# EAGLE board A13-OLinuXino-MICRO_Rev_C (EAGLE 4.16), part 1 of 3
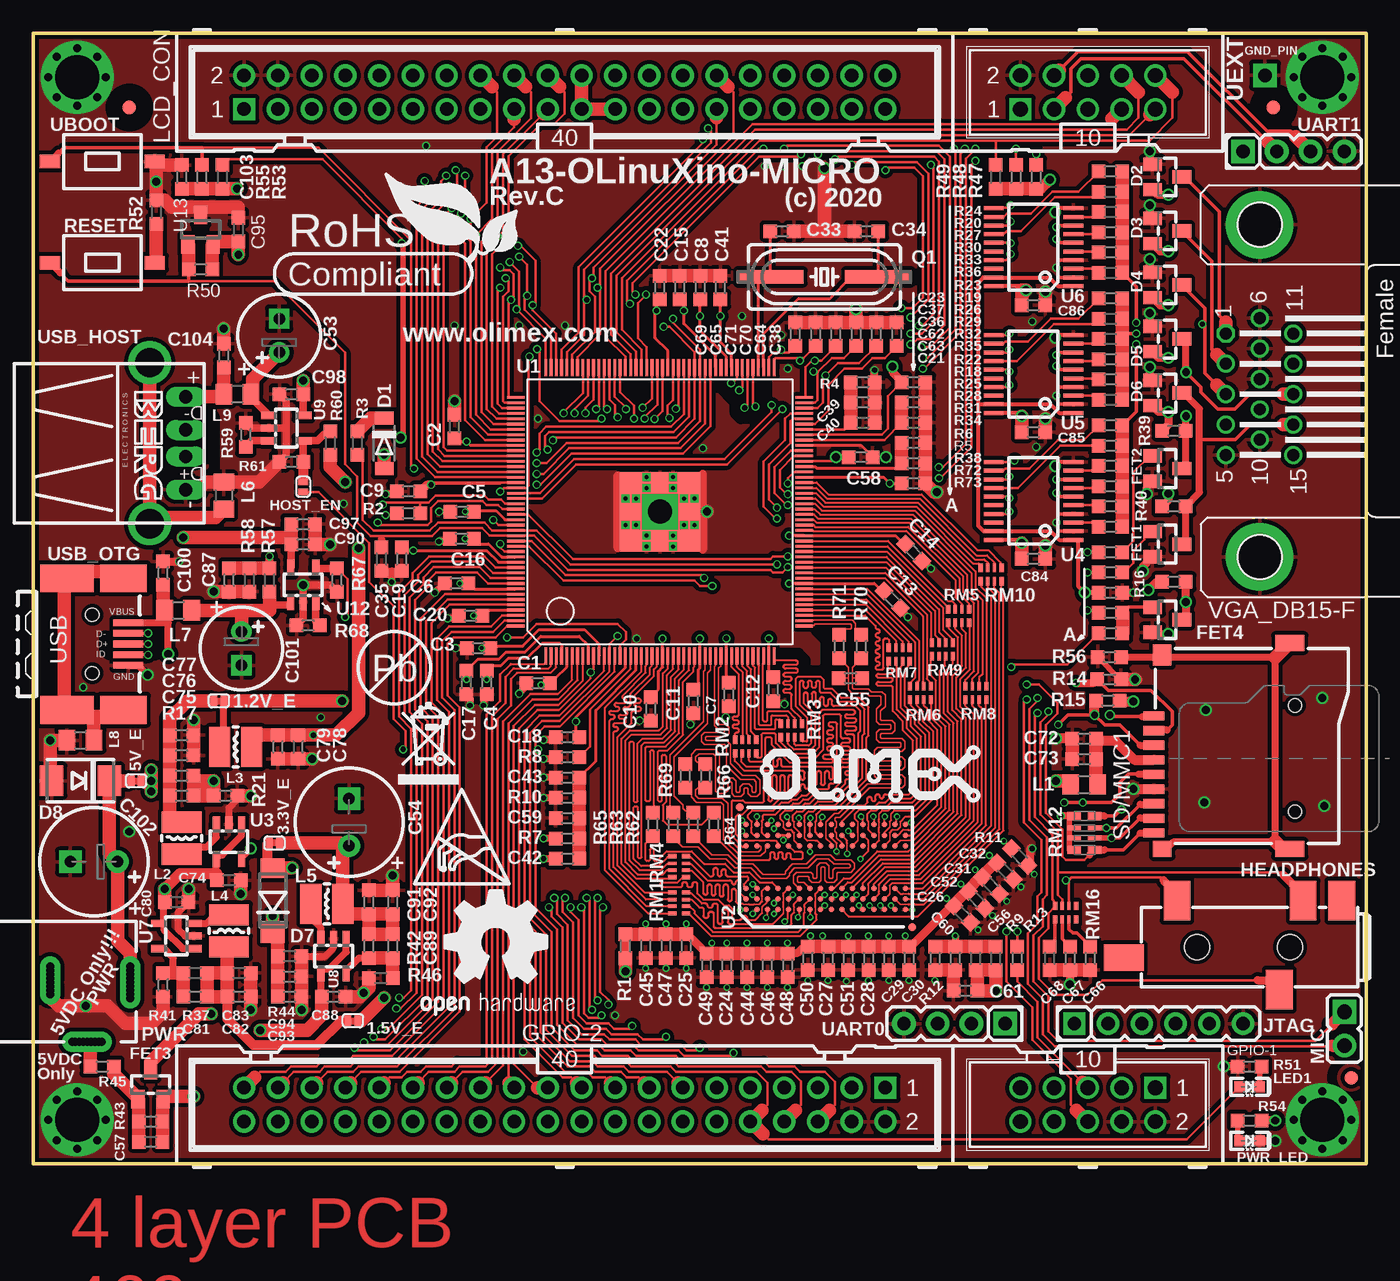
[diagram p2: board, top side]
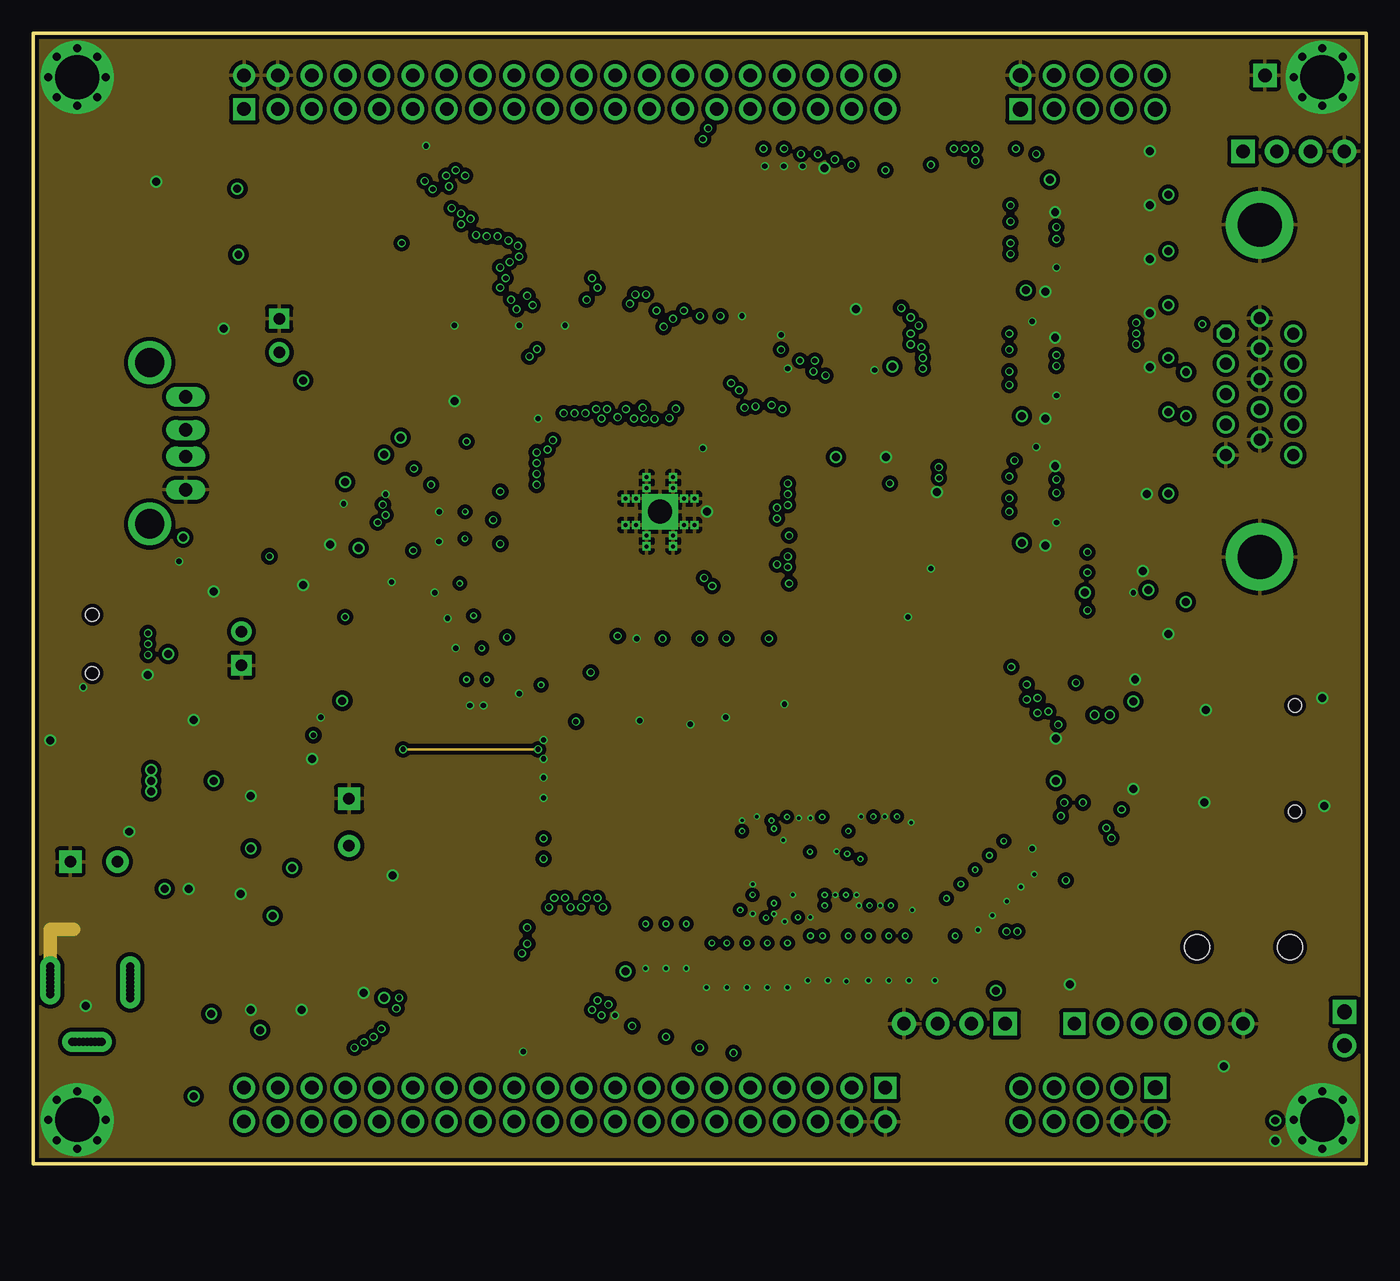
[diagram p3: board, inner layer Route2]
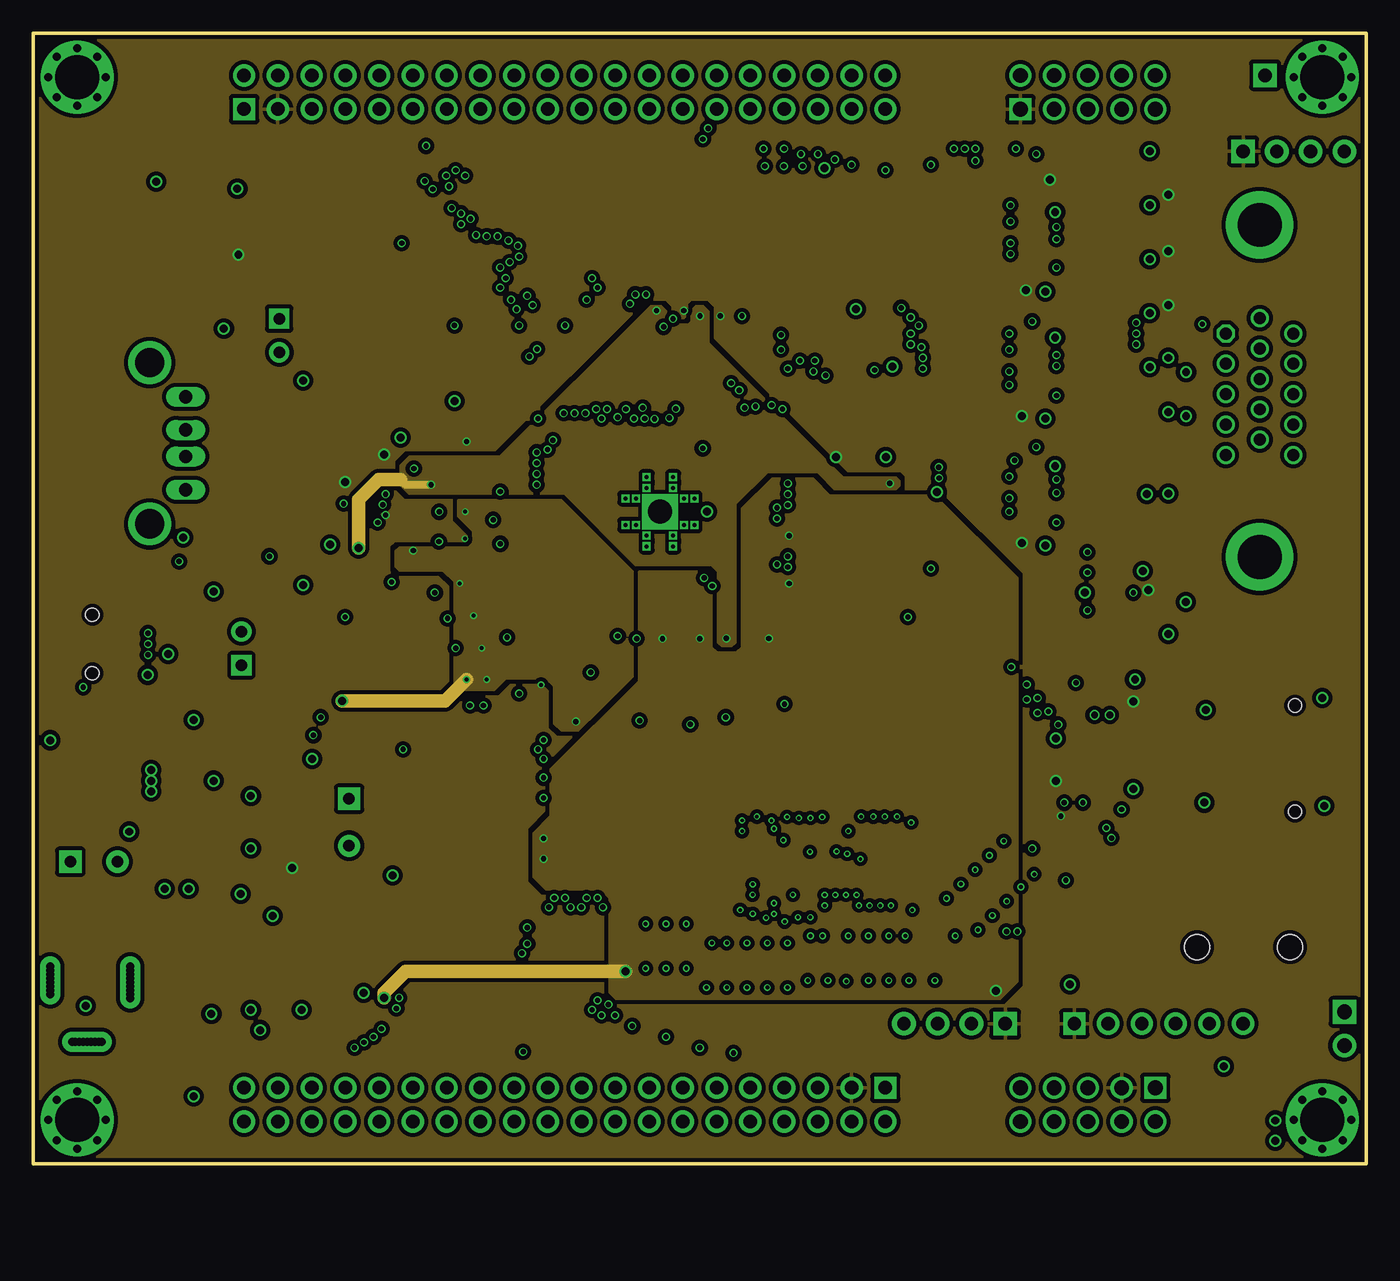
[diagram p4: board, inner layer Route15]
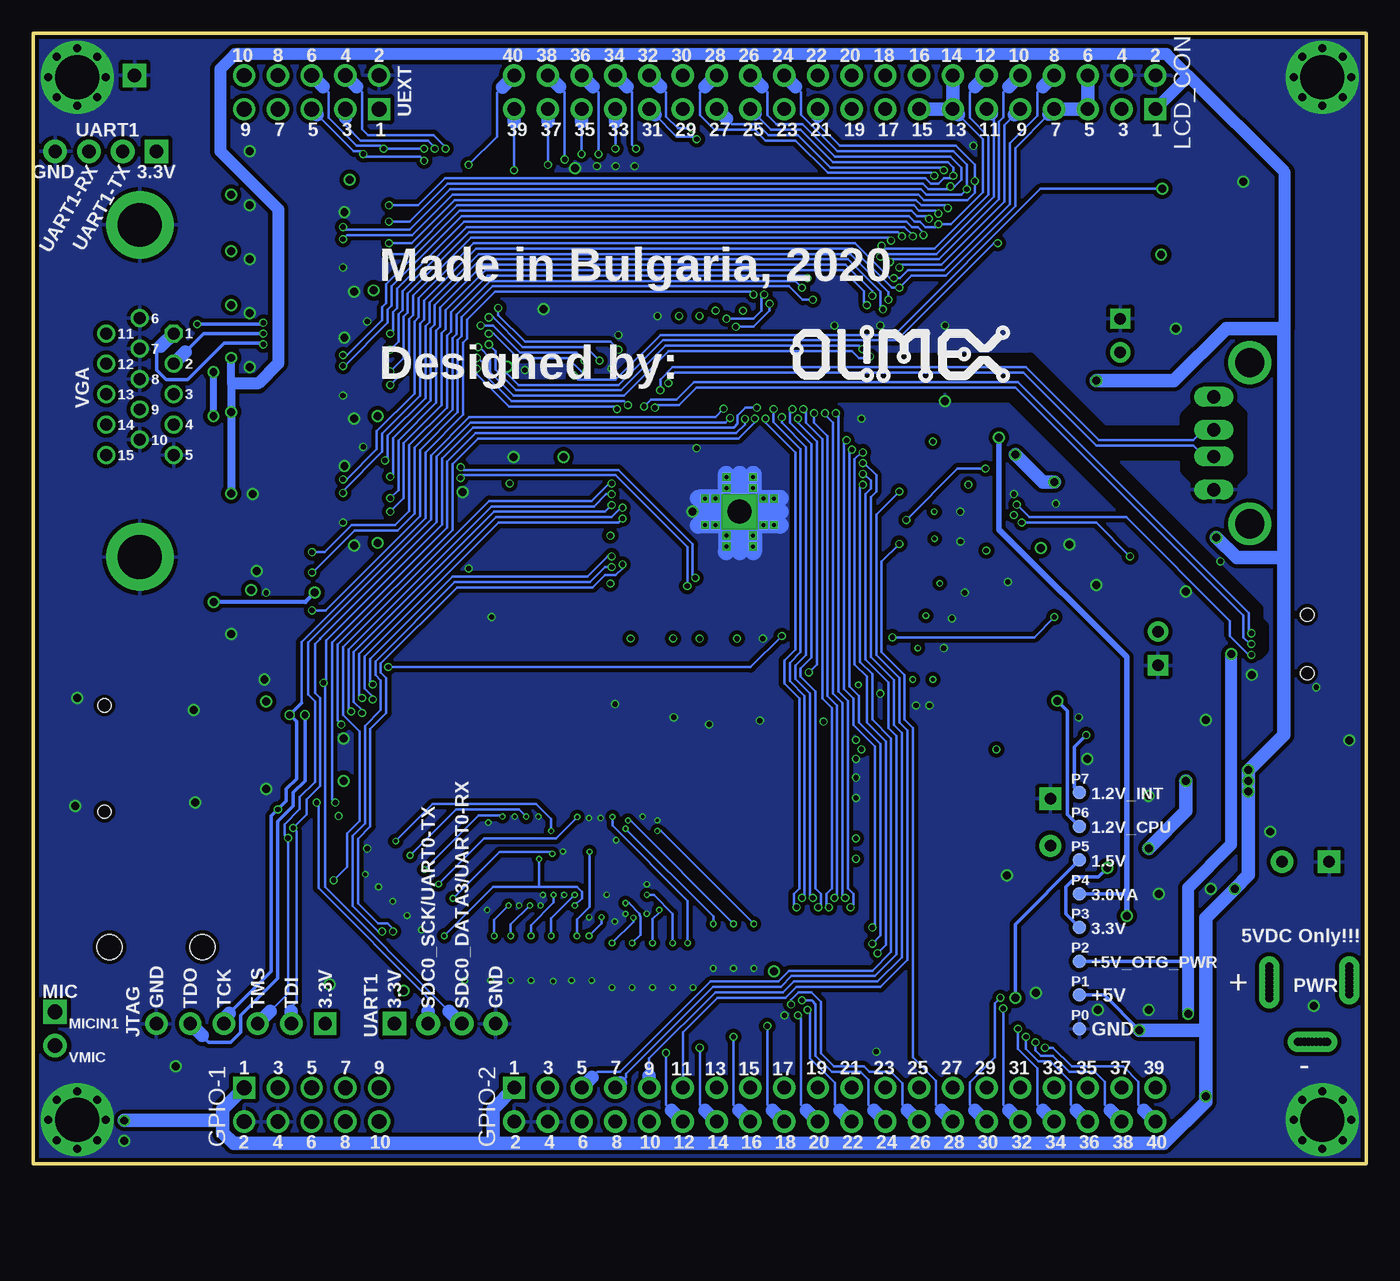
[diagram p5: board, bottom side, seen from below]

Size 100.33 x 85.09 mm. Coordinates in mm from the lower left corner, seen from the top.
Outline: 0,85.09 0,0 100.33,0 100.33,85.09 0,85.09
Copper layers (1*2+15*16): Top 0.035mm / dielectric 0.5mm / Route2 0.035mm / dielectric 0.5mm / Route15 0.035mm / dielectric 0.5mm / Bottom 0.035mm
Design rules "default": minimum track width 4.5mil, minimum drill 10mil, track to track 0.1321mm, track to pad 0.1321mm, pad to pad 0.1321mm, via to via 0.1321mm, smd to smd 1mil, copper to edge 10mil, drill to drill 8mil, minimum pad ring 6mil, minimum via ring 4mil, stop-mask expansion 4mil, vias tented up to drill 25mil, thermal gap 12mil
tRestrict: 28 lines
bRestrict: 31 lines

## Footprints (pad centres in the part's own frame; a part is rotated, then mirrored left to right if it is on the bottom)
SJ_1_SMALLER_CLOSE = smd 0.508 x 0.762: 1 -0.381,0; 2 0.381,0
C0603_DWS = smd 1.016 x 1.016: 1 -0.889,0; 2 0.889,0
E2,5-6,3 = drill 0.864 pad 1.524 round: + -1.27,0 | drill 0.864 pad 1.524 square: - 1.27,0
E3,5-8 = drill 0.864 pad 1.676 round: + -1.778,0 | drill 0.864 pad 1.676 square: - 1.778,0
SOD-123 = smd 1 x 1.4: A 1.9,0; C -1.9,0
SOT23C(BAT54S) = smd 1.4 x 1: 1 1.1,-0.95; 2 1.1,0.95; 3 -1.1,0
MLL-41 = smd 1.45 x 1.8: A 2.445,0; K -2.445,0
DO214AA = smd 1.778 x 2.286: A 2.177,0; C -2.177,0
SOT23 = smd 1.4 x 1: 1 1.1,-0.95; 2 1.1,0.95; 3 -1.1,0
TEST_PAD40/70/SQUARE = drill 1.016 pad 1.778 square: P$1 0,0
ML10-MALE = drill 1.1 pad 1.676 square: 1 -5.08,-1.27 | drill 1.1 pad 1.676 round: 2 -5.08,1.27; 3 -2.54,-1.27; 4 -2.54,1.27; 5 0,-1.27; 6 0,1.27; 7 2.54,-1.27; 8 2.54,1.27; 9 5.08,-1.27; 10 5.08,1.27
ML40 = drill 1.016 pad 1.676 square: 1 -24.13,-1.27 | drill 1.016 pad 1.676 round: 2 -24.13,1.27; 3 -21.59,-1.27; 4 -21.59,1.27; 5 -19.05,-1.27; 6 -19.05,1.27; 7 -16.51,-1.27; 8 -16.51,1.27; 9 -13.97,-1.27; 10 -13.97,1.27; 11 -11.43,-1.27; 12 -11.43,1.27; 13 -8.89,-1.27; 14 -8.89,1.27; 15 -6.35,-1.27; 16 -6.35,1.27; 17 -3.81,-1.27; 18 -3.81,1.27; 19 -1.27,-1.27; 20 -1.27,1.27; 21 1.27,-1.27; 22 1.27,1.27; 23 3.81,-1.27; 24 3.81,1.27; 25 6.35,-1.27; 26 6.35,1.27; 27 8.89,-1.27; 28 8.89,1.27; 29 11.43,-1.27; 30 11.43,1.27; 31 13.97,-1.27; 32 13.97,1.27; 33 16.51,-1.27; 34 16.51,1.27; 35 19.05,-1.27; 36 19.05,1.27; 37 21.59,-1.27; 38 21.59,1.27; 39 24.13,-1.27; 40 24.13,1.27
PJ-W47S-05D2-LF_5PIN_V2 = smd 2 x 3: 1 2.1,-0.5; 2 14.5,-0.5; 3 6.8,6.2; 5 5,-0.5 | smd 3 x 2: 4 18.5,3.8 | hole 1.9: 6,3; 13,3
SJ_1_SMALLER = smd 0.508 x 0.762: 1 -0.381,0; 2 0.381,0
HN1X6 = drill 1 pad 1.676 square: 1 -6.35,0 | drill 1 pad 1.676 round: 2 -3.81,0; 3 -1.27,0; 4 1.27,0; 5 3.81,0; 6 6.35,0
L0805_5MIL_DWS = smd 1.27 x 1.524: 1 -1.016,0; 2 1.016,0
CD32 = smd 1.6 x 3: 1 -1.2,0; 2 1.2,0
LED-0603 = smd 0.8 x 0.8: A 0.762,0; C -0.762,0
JP1 = drill 1.1 pad 1.778 square: 1 0,-1.27 | drill 1.1 pad 1.778 round: 2 0,1.27
TESTPAD_40-ROUND = smd 1.016 x 1.016: 1 0,0
PWR_JACK_UNI_MILLING = drill 0.6 pad 1.5 round: + -0.196,4.75; +1 -0.196,5.05; +2 -0.196,5.35; +3 -0.196,5.65; +4 -0.196,4.45; +5 -0.196,4.15; +6 -0.196,3.85; +7 -0.196,3.55; +8 -0.196,5.95; - -6.196,4.75; -1 -6.196,5.05; -2 -6.196,5.35; -3 -6.196,4.45; -4 -6.196,4.15; -5 -6.196,5.65; -6 -6.196,3.85; -8 -6.196,5.95; -- -3.446,0.3; --1 -3.746,0.3; --2 -4.046,0.3; --3 -4.346,0.3; --4 -3.146,0.3; --5 -2.846,0.3; --6 -2.546,0.3; --14 -4.546,0.3; --15 -2.346,0.3
HC49/SMD2_THIN = smd 5 x 1: 1 -4.064,0; 2 4.064,0
0603_0R = smd 1.016 x 1.016: 1 -0.889,0; 2 0.889,0
R0603_5MIL_DWS = smd 1.016 x 1.016: 1 -0.889,0; 2 0.889,0
SW-TAKT_6X3.5_SMD = smd 1.016 x 1.524: P$1 0,3.937; P$2 0,-3.937
R_MATRIX_4_0402_25X625 = smd 0.325 x 0.625: 1.1 -0.79,-0.512; 1.2 -0.79,0.512; 4.1 0.79,-0.512; 4.2 0.79,0.512 | smd 0.25 x 0.625: 2.1 -0.25,-0.512; 2.2 -0.25,0.512; 3.1 0.25,-0.512; 3.2 0.25,0.512
R_MATRIX_4 = smd 0.635 x 1.016: 1.1 -1.27,-0.762; 1.2 -1.27,0.762; 4.1 1.27,-0.762; 4.2 1.27,0.762 | smd 0.381 x 1.016: 2.1 -0.381,-0.762; 2.2 -0.381,0.762; 3.1 0.381,-0.762; 3.2 0.381,0.762
TFC-WPAPR-08 = smd 1.6 x 0.7: 1 -6.994,2.25; 2 -6.994,1.15; 3 -6.994,0.05; 4 -6.994,-1.05; 5 -6.994,-2.15; 6 -6.994,-3.25; 7 -6.994,-4.35; 8 -6.994,-5.45; 9 -6.994,-6.55 | smd 1.4 x 1.2: 10 -6.369,-7.75 | smd 1.4 x 1.6: 11 -6.369,6.85 | smd 2.2 x 1.2: 12 3.231,-7.75; 13 3.231,7.75 | hole 1: 3.631,-4.95; 3.631,3.05
TQFP176 = smd 0.2 x 1.3: 1 -8.6,-10.85; 2 -8.2,-10.85; 3 -7.8,-10.85; 4 -7.4,-10.85; 5 -7,-10.85; 6 -6.6,-10.85; 7 -6.2,-10.85; 8 -5.8,-10.85; 9 -5.4,-10.85; 10 -5,-10.85; 11 -4.6,-10.85; 12 -4.2,-10.85; 13 -3.8,-10.85; 14 -3.4,-10.85; 15 -3,-10.85; 16 -2.6,-10.85; 17 -2.2,-10.85; 18 -1.8,-10.85; 19 -1.4,-10.85; 20 -1,-10.85; 21 -0.6,-10.85; 22 -0.2,-10.85; 23 0.2,-10.85; 24 0.6,-10.85; 25 1,-10.85; 26 1.4,-10.85; 27 1.8,-10.85; 28 2.2,-10.85; 29 2.6,-10.85; 30 3,-10.85; 31 3.4,-10.85; 32 3.8,-10.85; 33 4.2,-10.85; 34 4.6,-10.85; 35 5,-10.85; 36 5.4,-10.85; 37 5.8,-10.85; 38 6.2,-10.85; 39 6.6,-10.85; 40 7,-10.85; 41 7.4,-10.85; 42 7.8,-10.85; 43 8.2,-10.85; 44 8.6,-10.85; 89 8.6,10.85; 90 8.2,10.85; 91 7.8,10.85; 92 7.4,10.85; 93 7,10.85; 94 6.6,10.85; 95 6.2,10.85; 96 5.8,10.85; 97 5.4,10.85; 98 5,10.85; 99 4.6,10.85; 100 4.2,10.85; 101 3.8,10.85; 102 3.4,10.85; 103 3,10.85; 104 2.6,10.85; 105 2.2,10.85; 106 1.8,10.85; 107 1.4,10.85; 108 1,10.85; 109 0.6,10.85; 110 0.2,10.85; 111 -0.2,10.85; 112 -0.6,10.85; 113 -1,10.85; 114 -1.4,10.85; 115 -1.8,10.85; 116 -2.2,10.85; 117 -2.6,10.85; 118 -3,10.85; 119 -3.4,10.85; 120 -3.8,10.85; 121 -4.2,10.85; 122 -4.6,10.85; 123 -5,10.85; 124 -5.4,10.85; 125 -5.8,10.85; 126 -6.2,10.85; 127 -6.6,10.85; 128 -7,10.85; 129 -7.4,10.85; 130 -7.8,10.85; 131 -8.2,10.85; 132 -8.6,10.85 | smd 1.3 x 0.2: 45 10.85,-8.6; 46 10.85,-8.2; 47 10.85,-7.8; 48 10.85,-7.4; 49 10.85,-7; 50 10.85,-6.6; 51 10.85,-6.2; 52 10.85,-5.8; 53 10.85,-5.4; 54 10.85,-5; 55 10.85,-4.6; 56 10.85,-4.2; 57 10.85,-3.8; 58 10.85,-3.4; 59 10.85,-3; 60 10.85,-2.6; 61 10.85,-2.2; 62 10.85,-1.8; 63 10.85,-1.4; 64 10.85,-1; 65 10.85,-0.6; 66 10.85,-0.2; 67 10.85,0.2; 68 10.85,0.6; 69 10.85,1; 70 10.85,1.4; 71 10.85,1.8; 72 10.85,2.2; 73 10.85,2.6; 74 10.85,3; 75 10.85,3.4; 76 10.85,3.8; 77 10.85,4.2; 78 10.85,4.6; 79 10.85,5; 80 10.85,5.4; 81 10.85,5.8; 82 10.85,6.2; 83 10.85,6.6; 84 10.85,7; 85 10.85,7.4; 86 10.85,7.8; 87 10.85,8.2; 88 10.85,8.6; 133 -10.85,8.6; 134 -10.85,8.2; 135 -10.85,7.8; 136 -10.85,7.4; 137 -10.85,7; 138 -10.85,6.6; 139 -10.85,6.2; 140 -10.85,5.8; 141 -10.85,5.4; 142 -10.85,5; 143 -10.85,4.6; 144 -10.85,4.2; 145 -10.85,3.8; 146 -10.85,3.4; 147 -10.85,3; 148 -10.85,2.6; 149 -10.85,2.2; 150 -10.85,1.8; 151 -10.85,1.4; 152 -10.85,1; 153 -10.85,0.6; 154 -10.85,0.2; 155 -10.85,-0.2; 156 -10.85,-0.6; 157 -10.85,-1; 158 -10.85,-1.4; 159 -10.85,-1.8; 160 -10.85,-2.2; 161 -10.85,-2.6; 162 -10.85,-3; 163 -10.85,-3.4; 164 -10.85,-3.8; 165 -10.85,-4.2; 166 -10.85,-4.6; 167 -10.85,-5; 168 -10.85,-5.4; 169 -10.85,-5.8; 170 -10.85,-6.2; 171 -10.85,-6.6; 172 -10.85,-7; 173 -10.85,-7.4; 174 -10.85,-7.8; 175 -10.85,-8.2; 176 -10.85,-8.6 | smd 6 x 6: GND_PAD 0,0 | drill 1.8 pad 2.184 square: P$2 0,0 | drill 0.3 pad 0.406 square: P$3 -2.6,-1; P$4 -1.8,-1; P$5 -1,-2.6; P$6 -1,-1.8; P$7 1,-2.6; P$8 1,-1.8; P$9 2.6,-1; P$10 1.8,-1; P$11 -2.6,1; P$12 -1.8,1; P$13 2.6,1; P$14 1.8,1; P$15 -1,2.6; P$16 -1,1.8; P$17 1,2.6; P$18 1,1.8
FBGA96@1 = smd 0.4 x 0.4: A1 -3.2,6; A2 -2.4,6; A3 -1.6,6; A7 1.6,6; A8 2.4,6; A9 3.2,6; B1 -3.2,5.2; B2 -2.4,5.2; B3 -1.6,5.2; B7 1.6,5.2; B8 2.4,5.2; B9 3.2,5.2; C1 -3.2,4.4; C2 -2.4,4.4; C3 -1.6,4.4; C7 1.6,4.4; C8 2.4,4.4; C9 3.2,4.4; D1 -3.2,3.6; D2 -2.4,3.6; D3 -1.6,3.6; D7 1.6,3.6; D8 2.4,3.6; D9 3.2,3.6; E1 -3.2,2.8; E2 -2.4,2.8; E3 -1.6,2.8; E7 1.6,2.8; E8 2.4,2.8; E9 3.2,2.8; F1 -3.2,2; F2 -2.4,2; F3 -1.6,2; F7 1.6,2; F8 2.4,2; F9 3.2,2; G1 -3.2,1.2; G2 -2.4,1.2; G3 -1.6,1.2; G7 1.6,1.2; G8 2.4,1.2; G9 3.2,1.2; H1 -3.2,0.4; H2 -2.4,0.4; H3 -1.6,0.4; H7 1.6,0.4; H8 2.4,0.4; H9 3.2,0.4; J1 -3.2,-0.4; J2 -2.4,-0.4; J3 -1.6,-0.4; J7 1.6,-0.4; J8 2.4,-0.4; J9 3.2,-0.4; K1 -3.2,-1.2; K2 -2.4,-1.2; K3 -1.6,-1.2; K7 1.6,-1.2; K8 2.4,-1.2; K9 3.2,-1.2; L1 -3.2,-2; L2 -2.4,-2; L3 -1.6,-2; L7 1.6,-2; L8 2.4,-2; L9 3.2,-2; M1 -3.2,-2.8; M2 -2.4,-2.8; M3 -1.6,-2.8; M7 1.6,-2.8; M8 2.4,-2.8; M9 3.2,-2.8; N1 -3.2,-3.6; N2 -2.4,-3.6; N3 -1.6,-3.6; N7 1.6,-3.6; N8 2.4,-3.6; N9 3.2,-3.6; P1 -3.2,-4.4; P2 -2.4,-4.4; P3 -1.6,-4.4; P7 1.6,-4.4; P8 2.4,-4.4; P9 3.2,-4.4; R1 -3.2,-5.2; R2 -2.4,-5.2; R3 -1.6,-5.2; R7 1.6,-5.2; R8 2.4,-5.2; R9 3.2,-5.2; T1 -3.2,-6; T2 -2.4,-6; T3 -1.6,-6; T7 1.6,-6; T8 2.4,-6; T9 3.2,-6 | smd 0.6 x 0.6: FID1 -4.5,-6.5; FID2 4.5,6.5
SOT23-5 = smd 1.2 x 0.55: 1 1.3,-0.95; 2 1.3,0; 3 1.3,0.95; 4 -1.3,0.95; 5 -1.3,-0.95
PW = smd 0.3 x 1.5: 1 -2.925,-3; 2 -2.275,-3; 3 -1.625,-3; 4 -0.975,-3; 5 -0.325,-3; 6 0.325,-3; 7 0.975,-3; 8 1.625,-3; 9 2.275,-3; 10 2.925,-3; 11 2.925,3; 12 2.275,3; 13 1.625,3; 14 0.975,3; 15 0.325,3; 16 -0.325,3; 17 -0.975,3; 18 -1.625,3; 19 -2.275,3; 20 -2.925,3
FIDUCIAL-1X3 = smd 1 x 1: 1 0,0
HN1X4 = drill 1 pad 1.778 square: 1 -3.81,0 | drill 1 pad 1.778 round: 2 -1.27,0; 3 1.27,0; 4 3.81,0
USB_PN87520_HOST_PTH = drill 1 long: 1 -3.5,2.71; 2 -1,2.71; 3 1,2.71; 4 3.5,2.71 | drill 2.2 round: P$1 6.07,0; P$2 -6.07,0
USB_MINI_9PIN = smd 2.25 x 0.5: D+ -3.722,0; D- -3.722,-0.8; GND -3.722,1.6; ID -3.722,0.8; VBUS -3.722,-1.6 | smd 4 x 2.1: GND1 0.884,-4.95; GND3 0.884,4.95 | smd 3.5 x 2.1: GND2 -3.366,-4.95; GND4 -3.366,4.95 | hole 1: -1.016,-2.2; -1.016,2.2
DB15-F_22MM = drill 0.9 octagon: 1 4.329,6.35 | drill 0.9 round: 2 2.043,6.35; 3 -0.243,6.35; 4 -2.529,6.35; 5 -4.815,6.35; 6 5.472,3.81; 7 3.186,3.81; 8 0.9,3.81; 9 -1.386,3.81; 10 -3.672,3.81; 11 4.329,1.27; 12 2.043,1.27; 13 -0.243,1.27; 14 -2.529,1.27; 15 -4.815,1.27 | drill 3.302 pad 5.08 round: GND1 -12.497,3.81; GND2 12.497,3.81

## Placement (x,y rotation side)
1.2V_E  Close  [SJ_1_SMALLER_CLOSE]  13.97,34.85 0 top
1.5V_E  Close  [SJ_1_SMALLER_CLOSE]  24.05,10.77 0 top
3.3V_E  Close  [SJ_1_SMALLER_CLOSE]  18.16,24.13 180 top
5V_E  Close  [SJ_1_SMALLER_CLOSE]  7.75,28.83 0 top
C1  100nF  [C0603_DWS]  38,36.17 0 top
C2  22uF/6.3V  [C0603_DWS]  31.7,55.47 270 top
C3  22uF/6.3V  [C0603_DWS]  33.53,38.81 0 top
C4  10uF/6.3V  [C0603_DWS]  34.14,36.22 90 top
C5  10uF/6.3V  [C0603_DWS]  32.28,49.07 0 top
C6  10uF/6.3V  [C0603_DWS]  31.88,43.69 0 top
C7  22uF/6.3V  [C0603_DWS]  52.35,35.33 90 top
C8  10uF/6.3V  [C0603_DWS]  50.19,65.94 270 top
C9  10uF/6.3V  [C0603_DWS]  28.24,50.6 0 top
C10  22uF/6.3V  [C0603_DWS]  46.48,34.24 90 top
C11  100nF  [C0603_DWS]  49.68,34.8 90 top
C12  10uF/6.3V  [C0603_DWS]  55.7,35.71 90 top
C13  100nF  [C0603_DWS]  64.64,42.47 135 top
C14  10uF/6.3V  [C0603_DWS]  66.27,46 135 top
C15  100nF  [C0603_DWS]  48.67,65.94 270 top
C16  100nF  [C0603_DWS]  32.26,47.04 0 top
C17  100nF  [C0603_DWS]  32.61,36.22 90 top
C18  100nF  [C0603_DWS]  40.21,32.11 0 top
C19  100nF  [C0603_DWS]  27.74,45.52 90 top
C20  100nF  [C0603_DWS]  32.92,41.25 0 top
C21  100nF  [C0603_DWS]  66.24,51.21 180 top
C22  100nF  [C0603_DWS]  47.14,65.94 270 top
C23  22uF/6.3V  [C0603_DWS]  66.24,58.83 180 top
C24  100nF  [C0603_DWS]  52.2,14.94 270 top
C25  100nF  [C0603_DWS]  49.15,16.38 270 top
C26  100nF  [C0603_DWS]  69.92,18.79 315 top
C27  22uF/6.3V  [C0603_DWS]  59.82,15.47 270 top
C28  100nF  [C0603_DWS]  62.87,15.47 270 top
C29  100nF  [C0603_DWS]  64.39,15.47 270 top
C30  100nF  [C0603_DWS]  65.91,15.47 270 top
C31  100nF  [C0603_DWS]  72.08,20.94 315 top
C32  100nF  [C0603_DWS]  73.16,22.02 315 top
C33  33pF  [C0603_DWS]  56.36,70.18 180 top
C34  33pF  [C0603_DWS]  62.71,70.18 0 top
C35  NA  [C0603_DWS]  26.21,45.52 90 top
C36  10uF/6.3V  [C0603_DWS]  66.24,55.78 180 top
C37  100nF  [C0603_DWS]  66.24,57.3 180 top
C38  1uF  [C0603_DWS]  64.97,62.43 270 top
C39  100nF  [C0603_DWS]  62.43,57.3 180 top
C40  10uF/6.3V  [C0603_DWS]  62.43,55.78 180 top
C41  100nF  [C0603_DWS]  51.71,65.94 270 top
C42  100nF  [C0603_DWS]  40.21,22.96 0 top
C43  100nF  [C0603_DWS]  40.21,29.06 0 top
C44  100nF  [C0603_DWS]  53.72,14.94 270 top
C45  100nF  [C0603_DWS]  46.1,16.38 270 top
C46  100nF  [C0603_DWS]  55.24,14.94 270 top
C47  100nF  [C0603_DWS]  47.62,16.38 270 top
C48  100nF  [C0603_DWS]  56.77,14.94 270 top
C49  100nF  [C0603_DWS]  50.67,14.94 270 top
C50  22uF/6.3V  [C0603_DWS]  58.29,15.47 270 top
C51  100nF  [C0603_DWS]  61.34,15.47 270 top
C52  100nF  [C0603_DWS]  71,19.87 315 top
C53  100uF/16V/LOWESR/105C/6.3x11mm_RM2.5  [E2,5-6,3]  18.52,62.33 90 top
C54  NA  [E3,5-8]  23.77,25.7 90 top
C55  NA  [C0603_DWS]  61.49,36.55 0 top
C56  100nF  [C0603_DWS]  70.92,15.47 90 top
C57  100nF  [C0603_DWS]  8.84,1.65 180 top
C58  100nF  [C0603_DWS]  62.28,53.19 180 top
C59  100nF  [C0603_DWS]  40.21,26.01 0 top
C60  100nF  [C0603_DWS]  69.39,15.47 90 top
C61  NA(22uF/6.3V)  [C0603_DWS]  70.15,13.03 0 top
C62  10uF/6.3V  [C0603_DWS]  66.24,54.25 180 top
C63  100nF  [C0603_DWS]  66.24,52.73 180 top
C64  1nF  [C0603_DWS]  63.45,62.43 270 top
C65  1nF  [C0603_DWS]  58.88,62.43 270 top
C66  100nF  [C0603_DWS]  79.55,15.47 90 top
C67  100nF  [C0603_DWS]  78.03,15.47 90 top
C68  100nF  [C0603_DWS]  76.5,15.47 90 top
C69  1nF  [C0603_DWS]  57.35,62.43 270 top
C70  1nF  [C0603_DWS]  61.93,62.43 270 top
C71  1nF  [C0603_DWS]  60.4,62.43 270 top
C72  22uF/6.3V  [C0603_DWS]  79.1,31.98 0 top
C73  22uF/6.3V  [C0603_DWS]  79.1,30.45 0 top
C74  22uF/6.3V  [C0603_DWS]  14.73,21.34 0 top
C75  22pF  [C0603_DWS]  11.18,29.21 0 top
C76  22uF/6.3V  [C0603_DWS]  11.18,30.73 0 top
C77  22uF/6.3V  [C0603_DWS]  11.18,32.26 0 top
C78  10uF/6.3V  [C0603_DWS]  19.94,31.37 270 top
C79  1nF  [C0603_DWS]  18.41,31.37 270 top
C80  22uF/6.3V  [C0603_DWS]  10.79,19.68 0 top
C81  22pF  [C0603_DWS]  12.19,12.57 180 top
C82  22uF/6.3V  [C0603_DWS]  15.49,12.57 0 top
C83  22uF/6.3V  [C0603_DWS]  15.49,14.35 0 top
C84  100nF  [C0603_DWS]  75.29,45.52 0 top
C85  100nF  [C0603_DWS]  75.29,55.07 0 top
C86  100nF  [C0603_DWS]  75.29,64.62 0 top
C87  NA(100nF)  [C0603_DWS]  14.73,43.94 270 top
C88  22uF/6.3V  [C0603_DWS]  22.61,12.57 0 top
C89  47pF  [C0603_DWS]  27.05,16.38 270 top
C90  100nF  [C0603_DWS]  20.32,46.61 0 top
C91  22uF/6.3V  [C0603_DWS]  25.27,19.68 90 top
C92  22uF/6.3V  [C0603_DWS]  27.05,19.68 90 top
C93  22uF/6.3V  [C0603_DWS]  19.3,12.57 0 top
C94  22uF/6.3V  [C0603_DWS]  19.3,14.1 0 top
C95  100nF  [C0603_DWS]  15.44,70.31 90 top
C97  22uF/6.3V  [C0603_DWS]  20.32,48.13 0 top
C98  10uF/6.3V  [C0603_DWS]  19.43,57.91 180 top
C100  100nF  [C0603_DWS]  9.78,44.45 90 top
C101  100uF/16V/LOWESR/105C/6.3x11mm_RM2.5  [E2,5-6,3]  15.67,38.79 270 top
C102  470uF/16V/105C  [E3,5-8]  4.57,22.73 180 top
C103  1nF  [C0603_DWS]  11.18,74.27 90 top
C104  100nF  [C0603_DWS]  14.35,60.83 90 top
D1  1N5819(S4SOD-123)  [SOD-123]  26.42,54.23 270 top
D2  BAT54S  [SOT23C(BAT54S)]  85.34,74.27 180 top
D3  BAT54S  [SOT23C(BAT54S)]  85.34,70.21 180 top
D4  BAT54S  [SOT23C(BAT54S)]  85.34,66.14 180 top
D5  BAT54S  [SOT23C(BAT54S)]  85.34,62.08 180 top
D6  BAT54S  [SOT23C(BAT54S)]  85.34,58.01 180 top
D7  1N5819/SS14  [MLL-41]  18.03,19.81 90 top
D8  SMBJ6.0  [DO214AA]  3.56,28.83 180 top
FET1  BSS138  [SOT23]  85.34,46.63 180 top
FET2  BSS138  [SOT23]  85.34,52.32 180 top
FET3  IRLML6402  [SOT23]  8.84,5.97 270 top
FET4  BSS138  [SOT23]  85.34,40.94 180 top
GND_PIN  TESTPAD3  [TEST_PAD40/70/SQUARE]  92.71,81.92 0 top
GPIO-1  BH10S  [ML10-MALE]  79.38,4.45 180 top
GPIO-2  ML40  [ML40]  40.01,4.45 180 top
HEADPHONES  PJ-W47S-05D2-LF_V2  [PJ-W47S-05D2-LF_5PIN_V2]  100.58,19.3 180 top
HOST_EN  Open  [SJ_1_SMALLER]  20.32,50.95 90 top
JTAG  NA(HN1X6)  [HN1X6]  84.71,10.54 0 top
L1  FB0805/600R/2A  [L0805_5MIL_DWS]  79.1,28.55 0 top
L2  2.2uH/1.5A/DCR<0.1R/CD32  [CD32]  11.18,24.51 90 top
L3  2.2uH/1.5A/DCR<0.1R/CD32  [CD32]  15.24,31.37 0 top
L4  2.2uH/1.5A/DCR<0.1R/CD32  [CD32]  14.73,17.53 270 top
L5  2.2uH/1.5A/DCR<0.1R/CD32  [CD32]  22.1,19.56 0 top
L6  FB0805/600R/2A  [L0805_5MIL_DWS]  14.35,50.29 270 top
L7  FB0805/600R/2A  [L0805_5MIL_DWS]  10.92,41.66 0 top
L8  FB0805/600R/2A  [L0805_5MIL_DWS]  3.56,31.88 0 top
L9  FB0805/600R/2A  [L0805_5MIL_DWS]  15.37,57.91 180 top
LCD_CON  ML40  [ML40]  40.01,80.64 0 top
LED1  LED/GREEN/0603  [LED-0603]  91.54,5.79 180 top
MIC  NA(HN1x2)  [JP1]  98.68,10.16 180 top
P0  TESTPADTESTPAD_40-ROUND  [TESTPAD_40-ROUND]  21.59,10.16 0 bottom
P1  TESTPADTESTPAD_40-ROUND  [TESTPAD_40-ROUND]  21.59,12.7 0 bottom
P2  TESTPADTESTPAD_40-ROUND  [TESTPAD_40-ROUND]  21.59,15.24 0 bottom
P3  TESTPADTESTPAD_40-ROUND  [TESTPAD_40-ROUND]  21.59,17.78 0 bottom
P4  TESTPADTESTPAD_40-ROUND  [TESTPAD_40-ROUND]  21.59,20.32 0 bottom
P5  TESTPADTESTPAD_40-ROUND  [TESTPAD_40-ROUND]  21.59,22.86 0 bottom
P6  TESTPADTESTPAD_40-ROUND  [TESTPAD_40-ROUND]  21.59,25.4 0 bottom
P7  TESTPADTESTPAD_40-ROUND  [TESTPAD_40-ROUND]  21.59,27.94 0 bottom
PWR  YDJ-1136  [PWR_JACK_UNI_MILLING]  7.49,8.89 0 top
PWR_LED  LED/RED/0603  [LED-0603]  91.54,1.73 180 top
Q1  24Mhz/HU49SM/20ppm/20pf  [HC49/SMD2_THIN]  59.54,66.75 180 top
R1  0R(Board_Mounted)  [0603_0R]  44.58,16.38 90 top
R2  47k  [R0603_5MIL_DWS]  28.24,48.97 0 top
R3  47k  [R0603_5MIL_DWS]  24.38,54.23 90 top
R4  200k/1%  [R0603_5MIL_DWS]  62.43,58.83 0 top
R5  51R  [R0603_5MIL_DWS]  81.08,44.5 0 top
R6  51R  [R0603_5MIL_DWS]  81.08,46.02 0 top
R7  2k/1%  [R0603_5MIL_DWS]  40.21,24.49 180 top
R8  240R/1%  [R0603_5MIL_DWS]  40.21,30.58 0 top
R9  1k/1%  [R0603_5MIL_DWS]  72.44,15.47 270 top
R10  2k/1%  [R0603_5MIL_DWS]  40.21,27.53 0 top
R11  240R/1%  [R0603_5MIL_DWS]  74.23,23.1 135 top
R12  1k/1%  [R0603_5MIL_DWS]  67.87,15.47 90 top
R13  240R/1%  [R0603_5MIL_DWS]  74.07,15.47 270 top
R14  NA(1M)  [R0603_5MIL_DWS]  80.98,36.45 0 top
R15  10k  [R0603_5MIL_DWS]  80.87,34.85 0 top
R16  1k/1%  [R0603_5MIL_DWS]  85.85,43.79 180 top
R17  2k/1%  [R0603_5MIL_DWS]  11.18,27.69 0 top
R18  17.8k/1%  [R0603_5MIL_DWS]  81.08,54.05 0 top
R19  17.8k/1%  [R0603_5MIL_DWS]  81.08,63.6 0 top
R20  17.8k/1%  [R0603_5MIL_DWS]  81.08,73.15 0 top
R21  1.5k/1%  [R0603_5MIL_DWS]  14.48,27.69 0 top
R22  8.66k/1%  [R0603_5MIL_DWS]  81.08,55.58 0 top
R23  8.66k/1%  [R0603_5MIL_DWS]  81.08,65.13 0 top
R24  8.66k/1%  [R0603_5MIL_DWS]  81.08,74.68 0 top
R25  4.32k/1%  [R0603_5MIL_DWS]  81.08,52.53 0 top
R26  4.32k/1%  [R0603_5MIL_DWS]  81.08,62.08 0 top
R27  4.32k/1%  [R0603_5MIL_DWS]  81.08,71.63 0 top
R28  2.2k/1%  [R0603_5MIL_DWS]  81.08,51 0 top
R29  2.2k/1%  [R0603_5MIL_DWS]  81.08,60.55 0 top
R30  2.2k/1%  [R0603_5MIL_DWS]  81.08,70.1 0 top
R31  1.05k/1%  [R0603_5MIL_DWS]  81.08,49.48 0 top
R32  1.05k/1%  [R0603_5MIL_DWS]  81.08,59.03 0 top
R33  1.05k/1%  [R0603_5MIL_DWS]  81.08,68.58 0 top
R34  549R/1%  [R0603_5MIL_DWS]  81.08,47.96 0 top
R35  549R/1%  [R0603_5MIL_DWS]  81.08,57.51 0 top
R36  549R/1%  [R0603_5MIL_DWS]  81.08,67.06 0 top
R37  4.99k/1%  [R0603_5MIL_DWS]  12.19,14.35 180 top
R38  10k  [R0603_5MIL_DWS]  81.08,42.98 180 top
R39  1k/1%  [R0603_5MIL_DWS]  85.85,55.17 180 top
R40  1k/1%  [R0603_5MIL_DWS]  85.85,49.48 180 top
R41  3.3k/1%  [R0603_5MIL_DWS]  9.78,13.46 270 top
R42  100k/1%  [R0603_5MIL_DWS]  25.27,16.38 270 top
R43  10k  [R0603_5MIL_DWS]  8.84,3.17 0 top
R44  2.2k  [R0603_5MIL_DWS]  19.3,15.62 0 top
R45  1k/1%  [R0603_5MIL_DWS]  5.19,7.31 0 top
R46  22k/1%  [R0603_5MIL_DWS]  26.16,13.97 180 top
R47  2.2k  [R0603_5MIL_DWS]  75.49,74.27 270 top
R48  2.2k  [R0603_5MIL_DWS]  73.96,74.27 270 top
R49  47k  [R0603_5MIL_DWS]  72.44,74.27 270 top
R50  10k(NA)  [R0603_5MIL_DWS]  12.6,67.31 0 top
R51  2.2k  [R0603_5MIL_DWS]  91.54,7.32 0 top
R52  51R  [R0603_5MIL_DWS]  9.27,71.63 90 top
R53  100k/1%  [R0603_5MIL_DWS]  14.22,74.27 270 top
R54  2.2k  [R0603_5MIL_DWS]  91.54,3.25 180 top
R55  6.8k/1%  [R0603_5MIL_DWS]  12.7,74.27 90 top
R56  10k  [R0603_5MIL_DWS]  81,38.13 180 top
R57  47k  [R0603_5MIL_DWS]  17.78,43.94 270 top
R58  100k/1%  [R0603_5MIL_DWS]  16.26,43.94 90 top
R59  13k/1%  [R0603_5MIL_DWS]  16,54.86 270 top
R60  10k  [R0603_5MIL_DWS]  22.35,54.23 90 top
R61  NA  [R0603_5MIL_DWS]  19.43,52.83 0 top
R62  22R  [R0603_5MIL_DWS]  49.68,25.53 90 top
R63  22R  [R0603_5MIL_DWS]  48.16,25.53 90 top
R64  22R  [R0603_5MIL_DWS]  51.21,25.53 90 top
R65  22R  [R0603_5MIL_DWS]  46.63,25.53 90 top
R66  22R  [R0603_5MIL_DWS]  50.6,29.18 90 top
R67  200k/1%  [R0603_5MIL_DWS]  22.86,43.94 90 top
R68  13k/1%  [R0603_5MIL_DWS]  20.7,40.51 0 top
R69  22R  [R0603_5MIL_DWS]  49.07,29.18 90 top
R70  22R  [R0603_5MIL_DWS]  62.33,38.94 90 top
R71  22R  [R0603_5MIL_DWS]  60.66,38.94 90 top
R72  51R  [R0603_5MIL_DWS]  81.08,41.45 180 top
R73  NA  [R0603_5MIL_DWS]  81.08,39.93 180 top
RESET  T1107A(6x3.8x2.5mm)  [SW-TAKT_6X3.5_SMD]  5.21,67.82 270 top
RM1  RA0805_(4X0402)_22R  [R_MATRIX_4_0402_25X625]  48.62,19.63 270 top
RM2  RA0805_(4X0402)_22R  [R_MATRIX_4_0402_25X625]  53.62,31.39 180 top
RM3  RA0805_(4X0402)_22R  [R_MATRIX_4_0402_25X625]  57.06,32.61 180 top
RM4  RA0805_(4X0402)_22R  [R_MATRIX_4_0402_25X625]  48.62,22.35 270 top
RM5  RA0805_(4X0402)_22R  [R_MATRIX_4_0402_25X625]  69.65,41.22 180 top
RM6  RA0805_(4X0402)_22R  [R_MATRIX_4_0402_25X625]  66.78,35.43 180 top
RM7  RA0805_(4X0402)_22R  [R_MATRIX_4_0402_25X625]  65.18,38.33 180 top
RM8  RA0805_(4X0402)_22R  [R_MATRIX_4_0402_25X625]  70.94,35.43 180 top
RM9  RA0805_(4X0402)_22R  [R_MATRIX_4_0402_25X625]  68.43,38.71 180 top
RM10  RA0805_(4X0402)_22R  [R_MATRIX_4_0402_25X625]  72.09,44.35 180 top
RM12  RA1206_(4X0603)_4B8_100K  [R_MATRIX_4]  79.12,24.89 90 top
RM16  RA0805_(4X0402)_22R  [R_MATRIX_4_0402_25X625]  77.7,18.9 0 top
SD/MMC1  MICRO_SD/TFC-WPAPR-08  [TFC-WPAPR-08]  91.34,31.45 0 top
U1  A13  [TQFP176]  47.17,49.07 0 top
U2  H5TQ2G63BFR  [FBGA96@1]  59.66,22.33 90 top
U3  SY8008C(AA)C  [SOT23-5]  14.73,24.26 90 top
U4  SN74ALVC244  [PW]  75.29,49.89 90 top
U5  SN74ALVC244  [PW]  75.29,59.44 90 top
U6  SN74ALVC244  [PW]  75.29,68.99 90 top
U7  SY8008C(AA)C  [SOT23-5]  10.79,17.14 0 top
U8  SY8008C(AA)C  [SOT23-5]  22.61,15.62 90 top
U9  SY6280  [SOT23-5]  19.05,55.37 180 top
U12  SY6280  [SOT23-5]  20.32,43.56 270 top
U13  MCP130T-300I/TT  [SOT23]  12.6,70.31 270 top
U$1  FIDUCIAL  [FIDUCIAL-1X3]  99.19,6.48 180 top
U$2  FIDUCIAL  [FIDUCIAL-1X3]  7.24,79.5 180 top
U$3  FIDUCIAL  [FIDUCIAL-1X3]  93.34,79.5 180 top
U$4  [OLIMEX1_V]  72.44,27.08 0 top
U$5  [LOGO-OPENHARDWARE_8X8]  34.8,16.59 0 top
U$8  [OLIMEX1_V]  25.65,58.67 0 bottom
U$9  [PB]  27.18,37.34 0 top
U$10  [ESD_SYMBOL]  28.7,21.06 0 top
U$11  [RECYCLE_BIN1/8]  27.46,28.55 0 top
U$12  [ROHS]  19.18,66.09 0 top
UART0  NA(HN1X4)  [HN1X4]  69.34,10.54 180 top
UART1  HN1X4  [HN1X4]  94.87,76.2 0 top
UBOOT  T1107A(6x3.8x2.5mm)  [SW-TAKT_6X3.5_SMD]  5.21,75.44 270 top
UEXT  BH10S  [ML10-MALE]  79.38,80.64 0 top
USB_HOST  USB_A  [USB_PN87520_HOST_PTH]  8.76,54.23 270 top
USB_OTG  USB-OTG  [USB_MINI_9PIN]  3.43,39.12 180 top
VGA_DB15-F  VGA15  [DB15-F_22MM]  96.11,58.17 90 top

## Tracks (layer width: path | path; a pad name or v marks a point on that pad's centre or on a via)
+5V  (via drill 0.6)
  Top 0.508: U7.1 11.24,16.2 9.83,17.6 9.83,18.03 9.77,18.09 | 9.77,18.09 U7.4 | 9.77,18.09 9.77,19.55 C80.1 | C74.1 13.78,21.4 U3.4 13.78,23.24 14.22,23.24 15.68,24.7 U3.1 | C88.1 21.66,12.63 U8.4 21.66,14.66 22.28,14.66 23.56,15.94 U8.1 | 8.26,28.83 5V_E.2
  Top 0.559: U9.5 20.32,56.32 C98.1 | U12.5 19.43,44.92 C90.1
  Top 0.61: D6.2 84.72,56.59 v85.45,56.59 85.45,55.65 R39.2 | D5.2 84.72,60.66 v85.45,60.66 | R40.2 85.45,49.96 v85.45,50.44 | v93.47,3.25 R54.1
  Top 0.762: v8.87,28.83 8.26,28.83
  Top 0.813: C74.1 13.84,21.84 11.05,21.84 v9.91,20.7
  Top 1.016: v9.91,20.7 C80.1 | C88.1 21.72,11.15 20.62,10.06 v17.07,10.06 | v8.87,29.64 v8.87,28.83 v8.87,28.02 | v20.32,58.93 C98.1 | 19.43,47.14 C97.1 | 19.43,47.14 C90.1 | v11.28,47.14 19.43,47.14 | C57.1 R43.2 9.73,4.81 FET3.2 10,5.08 v12.09,5.08
  Bottom 0.254: v17.07,10.06 19.71,12.7 P1.1
  Bottom 0.61: 85.45,58.73 v85.45,60.66 | v85.45,50.44 v85.45,56.59 85.45,58.73 | 85.29,58.73 85.45,58.73
  Bottom 0.914: 6.2,62.87 6.15,62.92 6.15,74.62 13.39,81.86 | 13.39,81.86 15.04,83.52 85.14,83.52 86.26,82.4 86.26,76.2 81.89,71.83 81.89,60.25 83.41,58.73 85.29,58.73 | 13.39,81.86 LCD_CON.1
  Bottom 1.016: 6.2,45.62 6.2,32.28 8.87,29.62 v8.87,28.83 v8.87,28.02 8.87,21.74 v9.91,20.7 12.09,18.52 12.09,10.06 | 6.2,45.62 6.2,62.87 10.54,62.87 14.48,58.93 v20.32,58.93 | 12.09,10.06 v17.07,10.06 | 12.09,10.06 v12.09,5.08 12.09,4.67 15.24,1.52 65.73,1.52 | v11.28,47.14 9.75,45.62 6.2,45.62 | GPIO-2.1 65.73,4.12 65.73,1.52 | GPIO-1.1 86.06,4.12 86.06,3.25 | 86.06,3.25 86.06,2.34 85.24,1.52 65.73,1.52 | 86.06,3.25 v93.47,3.25
+5V_OTG_PWR  (via drill 0.6)
  Top 0.508: 9.91,40.72 USB_OTG.VBUS | 9.91,40.72 L7.1 | v10.16,38.35 10.16,40.72 9.91,40.72
  Top 1.016: L7.1 9.78,41.78 C100.1 | FET3.3 8.84,7.66 12.45,11.28 v13.41,11.28
  Bottom 0.254: 13.41,15.24 P2.1
  Bottom 0.914: v13.41,11.28 13.41,15.24 13.41,20.78 10.16,24.03 v10.16,38.35
A0
  Top 0.152: RM5.1.2 70.51,40.64 70.51,37.21 69.77,36.47 69.77,34.39 70.48,33.68 70.48,25.98 66.53,22.03 64.24,22.03 63.26,21.05 U2.N3
A1
  Top 0.127: 64.46,24.33 64.46,24.92 | 64.67,25.13 65.05,25.13 | 65.26,25.34 65.26,25.74
  Top 0.152: RM6.3.2 66.53,34.49 66.98,34.04 66.98,33.3 67.74,32.54 67.74,27.48 66.4,26.14 65.66,26.14 65.26,25.74 | U2.P7 64.46,24.33 | 64.46,24.92 64.67,25.13 | 65.05,25.13 65.26,25.34
A2
  Top 0.152: U2.P3 64.06,20.98 64.52,21.43 66.8,21.43 71.09,25.73 71.09,34.06 70.69,34.46 RM8.3.2
A3
  Top 0.127: 63.66,20.53 63.66,20.95
  Top 0.152: U2.N2 63.66,20.33 63.66,20.53 | 63.66,20.95 63.66,21.02 64.38,21.73 66.67,21.73 70.79,25.86 70.79,33.83 70.15,34.47 RM8.4.2
A4
  Top 0.127: 64.46,25.34 64.46,25.75 | 64.56,25.85 64.56,26.34
  Top 0.152: RM6.4.2 66.06,34.84 66.06,34.49 66.67,33.88 66.67,33.17 67.44,32.41 67.44,27.61 66.42,26.59 64.81,26.59 64.56,26.34 | U2.P8 64.06,24.94 64.46,25.34 | 64.46,25.75 64.56,25.85
A5
  Top 0.127: 64.46,20.33 64.46,20.94
  Top 0.152: U2.P2 64.46,20.33 | 64.46,20.94 64.66,21.14 66.93,21.14 71.4,25.6 71.4,34.27 71.19,34.47 RM8.2.2
A6
  Top 0.127: 65.47,25.13 65.84,25.13
  Top 0.152: RM6.2.2 67.03,34.47 67.28,34.21 67.28,33.43 68.05,32.66 68.05,27 66.17,25.13 65.84,25.13 | U2.R8 65.07,24.73 65.47,25.13
A7
  Top 0.127: 65.26,19.53 65.86,19.53 | 65.96,19.53 66.35,19.53
  Top 0.152: RM10.2.2 72.33,43.34 72.72,42.95 72.72,25.2 67.05,19.53 66.35,19.53 | U2.R2 65.26,19.53 | 65.86,19.53 65.96,19.53
A8
  Top 0.152: RM6.1.2 67.59,34.9 67.59,33.55 68.35,32.79 68.35,26.87 66.2,24.73 U2.T8
A9
  Top 0.127: 65.46,20.33 65.89,20.33
  Top 0.152: RM10.4.2 71.37,43.76 71.37,43.41 72.11,42.67 72.11,25.45 66.99,20.33 65.89,20.33 | U2.R3 65.26,20.33 65.46,20.33
A10
  Top 0.127: 62.06,24.33 62.06,24.93 | 62.06,25.33 62.06,25.74
  Top 0.152: RM7.3.2 64.93,37.54 65,37.47 65,34.19 65.76,33.43 65.76,32.77 66.52,32 66.52,27.99 66.04,27.51 64.43,27.51 64.12,27.2 63.65,27.2 63.35,26.9 62.92,26.9 62.69,26.67 62.2,26.67 61.85,26.32 61.85,25.95 62.06,25.74 | U2.L7 62.06,24.33 | 62.06,24.93 62.06,25.33
A11
  Top 0.127: 65.26,24.33 66.24,24.33
  Top 0.152: U2.R7 65.26,24.33 | RM9.4.2 67.56,38.12 67.56,36.75 67.94,36.37 67.94,33.63 68.66,32.92 68.66,26.75 66.24,24.33
A12
  Top 0.127: 63.66,24.33 63.66,24.93 | 63.66,25.33 63.66,25.73 | 63.66,25.95 63.66,26.35
  Top 0.152: RM7.1.2 65.97,37.57 65.61,37.21 65.61,34.44 66.37,33.68 66.37,33.05 67.13,32.28 67.13,27.74 66.29,26.9 64.68,26.9 64.38,26.59 63.91,26.59 63.66,26.35 | U2.N7 63.66,24.33 | 63.66,24.93 63.66,25.33 | 63.66,25.73 63.66,25.95
A13
  Top 0.152: RM8.1.2 71.7,34.89 71.7,25.48 66.95,20.73 U2.T3
BA0
  Top 0.127: 62.86,20.53 62.86,20.95
  Top 0.152: RM5.2.2 69.9,40.24 70.21,39.93 70.21,37.34 69.47,36.6 69.47,34.27 70.18,33.55 70.18,26.11 66.4,22.33 64.1,22.33 62.86,21.09 62.86,20.95 | U2.M2 62.86,20.33 62.86,20.53
BA1
  Top 0.127: 62.86,25.33 62.86,25.75
  Top 0.152: RM7.2.2 65.43,37.54 65.3,37.41 65.3,34.31 66.06,33.55 66.06,32.92 66.83,32.16 66.83,27.86 66.17,27.2 64.55,27.2 64.25,26.9 63.78,26.9 63.48,26.59 63.05,26.59 62.77,26.31 62.77,25.84 62.86,25.75 | U2.N8 62.86,25.13 62.86,25.33
BA2
  Top 0.152: RM5.3.2 69.4,40.26 69.9,39.75 69.9,37.47 69.16,36.73 69.16,34.14 69.88,33.43 69.88,26.24 66.26,22.62 63.94,22.62 62.46,21.14 U2.M3
CASN
  Top 0.152: RM9.1.2 69.22,37.65 68.56,36.98 68.56,33.88 69.27,33.17 69.27,26.49 65.99,23.22 63.67,23.22 61.63,21.18 61.32,21.18 U2.K3
CKE
  Top 0.152: U2.K9 60.86,25.77 62.07,26.98 62.56,26.98 62.79,27.2 62.79,27.47 arc-90 62.94,27.62 arc-90 63.09,27.47 63.09,27.45 arc90 63.25,27.29 arc90 63.4,27.45 63.4,27.66 arc-90 63.55,27.81 arc-90 63.7,27.66 arc90 63.86,27.51 arc90 64.01,27.66 arc-90 64.16,27.81 65.91,27.81 66.22,28.12 66.22,31.85 65.46,32.61 65.46,33.3 64.69,34.06 64.69,35.81 arc90 64.54,35.97 63.63,35.97 arc-90 63.48,36.12 arc-90 63.63,36.27 64.54,36.27 arc90 64.69,36.42 arc90 64.54,36.58 63.63,36.58 arc-90 63.48,36.73 arc-90 63.63,36.88 64.61,36.88 64.68,36.96 64.68,37.11 64.61,37.19 64.39,37.19 64.31,37.26 64.31,37.74 RM7.4.2
CLK
  Top 0.114: U2.J7 60.06,24.1 59.66,24.5 59.66,25.73 60.3,26.36 60.59,26.36 62.8,28.57 65.23,28.57 65.3,28.65 65.3,28.88 65.23,28.96 63.55,28.96 63.32,29.18 63.32,29.72 63.55,29.95 65.23,29.95 65.3,30.02 65.3,30.25 65.23,30.33 63.55,30.33 63.32,30.56 63.32,31.09 63.55,31.32 65.23,31.32 65.3,31.39 65.3,31.62 65.23,31.7 63.7,31.7 63.48,31.93 63.48,32.46 63.7,32.69 64.47,32.69 64.54,32.77 64.54,32.99 64.47,33.07 63.7,33.07 63.48,33.3 63.48,34.21 63.82,34.56 63.82,35.12 63.73,35.2 62.94,35.2 62.71,35.43 61.59,35.43 61.34,35.69 61.34,36.55 | 61.34,36.55 61.34,37.36 R71.1 | 61.34,36.55 C55.1
CLKN
  Top 0.114: U2.K7 60.86,24.14 60.46,24.54 60.46,24.91 60.35,25.02 60.35,25.24 60.46,25.35 60.46,25.71 60.35,25.82 60.35,25.98 60.43,26.06 60.72,26.06 62.93,28.27 65.38,28.27 65.61,28.5 65.61,29.03 65.38,29.26 63.7,29.26 63.63,29.34 63.63,29.57 63.7,29.64 65.38,29.64 65.61,29.87 65.61,30.4 65.38,30.63 63.7,30.63 63.63,30.71 63.63,30.94 63.7,31.01 65.38,31.01 65.61,31.24 65.61,31.77 65.38,32 63.86,32 63.78,32.08 63.78,32.31 63.86,32.38 64.62,32.38 64.85,32.61 64.85,33.15 64.62,33.38 63.86,33.38 63.78,33.45 63.78,34.06 64.12,34.4 64.12,35.27 63.88,35.51 63.09,35.51 62.87,35.74 61.73,35.74 61.65,35.83 61.65,36.55 | 61.65,36.55 C55.2 | 61.65,36.55 61.65,37.36 R70.1
D0
  Top 0.127: 56.45,18.85 56.45,18.86 56.46,18.87 56.46,19.33 | 56.46,19.73 56.46,20.15
  Top 0.152: 56.46,19.33 56.46,19.73 | RM1.1.2 49.21,20.34 49.55,20.34 50.32,19.58 50.6,19.58 arc-90 50.75,19.43 arc90 50.9,19.28 50.98,19.28 arc90 51.13,19.43 arc-90 51.28,19.58 51.36,19.58 arc-90 51.51,19.43 51.51,18.21 arc90 51.66,18.06 51.74,18.06 arc90 51.89,18.21 51.89,19 arc-90 52.05,19.15 52.12,19.15 arc-90 52.27,19 52.27,18.21 arc90 52.43,18.06 55.66,18.06 56.45,18.85 | 56.46,20.15 56.46,20.37 56.82,20.73 U2.E3
D1
  Top 0.127: 57.26,24.33 57.26,24.92 | 57.05,25.13 56.66,25.13 | 56.46,25.33 56.46,25.73
  Top 0.152: U2.F7 57.26,24.33 | 57.26,24.92 57.05,25.13 | 56.66,25.13 56.46,25.33 | 56.46,25.73 56.24,25.96 56.24,26.25 56.58,26.59 57.12,26.59 57.34,26.82 57.79,26.82 58.09,27.13 58.47,27.13 58.93,27.58 60.08,27.58 61.11,28.62 61.11,28.8 arc-90 61.27,28.96 61.38,28.96 arc90 61.53,29.11 arc90 61.38,29.26 61.27,29.26 arc-90 61.11,29.41 arc-90 61.27,29.57 61.65,29.57 arc90 61.8,29.72 61.8,32.16 arc90 61.65,32.31 61.28,32.31 arc-90 61.11,32.47 arc-90 61.25,32.61 61.8,32.61 arc90 61.95,32.77 arc90 61.8,32.92 61.27,32.92 arc-90 61.11,33.07 arc-90 61.27,33.22 61.8,33.22 arc90 61.95,33.38 arc90 61.8,33.53 61.27,33.53 arc-90 61.11,33.68 arc-90 61.27,33.83 61.71,33.83 arc90 61.86,33.98 arc90 61.71,34.14 59.36,34.14 59.13,33.91 59.13,31.32 58.67,30.86 57.12,30.86 56.27,31.71 RM3.4.2
D2
  Top 0.127: 57.26,18.9 57.26,19.33
  Top 0.152: 57.26,19.33 57.26,19.54 57.65,19.93 U2.F2 | 57.26,18.9 57.09,18.73 57.09,18.07 56.77,17.75 51.36,17.75 arc-90 51.21,17.91 51.21,18.82 arc90 51.05,18.97 50.98,18.97 arc90 50.83,18.82 50.83,18.67 arc-90 50.67,18.52 50.6,18.52 arc-90 50.44,18.67 50.44,19.2 50.37,19.28 50.14,19.28 49.53,19.88 RM1.2.2
D3
  Top 0.127: 57.26,25.34 57.26,25.73
  Top 0.152: 57.26,25.34 57.66,24.94 U2.F8 | 57.26,25.73 57.18,25.81 57.18,26.23 57.47,26.52 57.92,26.52 58.22,26.82 58.6,26.82 59.05,27.28 60.2,27.28 62.1,29.18 62.1,32.42 62.26,32.58 62.26,34.09 61.9,34.44 60.27,34.44 arc-90 60.12,34.59 60.12,34.82 arc90 59.97,34.98 arc90 59.82,34.82 59.82,34.59 arc-90 59.66,34.44 arc-90 59.51,34.59 59.51,34.98 arc90 59.36,35.13 arc90 59.21,34.98 59.21,34.48 arc-90 59.05,34.33 arc-90 58.9,34.48 58.9,35.36 arc90 58.75,35.51 arc90 58.6,35.36 58.6,34.9 arc-90 58.45,34.75 arc-90 58.29,34.9 58.29,35.32 arc90 58.14,35.47 arc90 57.99,35.32 57.99,34.7 58.83,33.86 58.83,31.47 58.52,31.17 57.25,31.17 56.81,31.61 RM3.3.2
D4
  Top 0.127: 58.86,18.93 58.86,19.33 | 58.86,19.73 58.86,20.13
  Top 0.152: 58.86,20.13 58.86,20.33 U2.H3 | 58.86,18.93 58.86,18.83 58.95,18.73 58.95,18.36 57.74,17.14 51.03,17.14 49.33,18.84 RM1.4.2 | 58.86,19.33 58.86,19.73
D5
  Top 0.127: 58.86,25.33 58.86,25.7 | 58.94,25.87 58.94,26.24
  Top 0.152: U2.H8 59.09,24.73 58.86,24.96 58.86,25.33 | 58.86,25.7 58.86,25.74 58.94,25.82 58.94,25.87 | 58.94,26.24 58.94,26.3 59.31,26.67 60.46,26.67 62.71,28.92 62.71,32.08 62.87,32.23 62.87,34.37 62.18,35.05 60.82,35.05 60.13,35.74 59.6,35.74 59.51,35.83 59.51,36.42 59.28,36.65 57.53,36.65 57.38,36.5 57.38,34.44 58.23,33.59 58.23,31.77 57.92,31.77 57.85,31.85 RM3.1.2
D6
  Top 0.127: 58.06,18.9 58.06,19.33
  Top 0.152: 58.06,19.33 58.06,19.5 58.46,19.9 U2.G2 | 58.06,18.9 58.02,18.87 58.02,17.89 57.58,17.45 51.16,17.45 49.76,18.85 49.76,19.04 49.41,19.38 RM1.3.2
D7
  Top 0.127: 58.25,24.33 58.86,24.33 | 58.06,24.93 58.06,24.52 | 58.06,25.33 58.06,25.73 | 58.06,25.87 58.06,26.18
  Top 0.152: U2.H7 59.26,24.06 59,24.33 58.86,24.33 | 58.06,24.52 58.25,24.33 | 58.06,25.33 58.06,24.93 | 58.06,25.73 58.06,25.87 | 58.06,26.18 58.06,26.23 58.35,26.52 58.73,26.52 59.18,26.98 60.33,26.98 62.41,29.05 62.41,32.23 62.56,32.38 62.56,34.21 62.03,34.75 60.69,34.75 60.01,35.43 59.36,35.43 arc-90 59.21,35.59 59.21,36.2 arc90 59.05,36.35 arc90 58.9,36.2 58.9,35.97 arc-90 58.75,35.81 arc-90 58.6,35.97 58.6,36.2 arc90 58.45,36.35 arc90 58.29,36.2 58.29,35.93 arc-90 58.14,35.78 arc-90 57.99,35.93 57.99,36.2 arc90 57.84,36.35 arc90 57.68,36.2 57.68,34.57 58.52,33.73 58.52,31.62 58.37,31.47 57.4,31.47 57.31,31.56 RM3.2.2
D8
  Top 0.127: 53.48,24.33 53.86,24.33 | 54.26,24.33 54.66,24.33 | 55.06,24.33 55.46,24.33
  Top 0.152: 55.46,24.33 55.85,24.33 56.06,24.11 U2.D7 | 53.86,24.33 54.26,24.33 | 54.66,24.33 55.06,24.33 | 53.48,24.33 53.36,24.33 52.88,24.8 52.88,26.14 53.04,26.3 53.4,26.3 54,26.9 55.59,26.9 56.2,27.51 56.73,27.51 56.96,27.74 57.41,27.74 57.76,28.09 57.76,28.42 arc-90 57.91,28.57 arc-90 58.06,28.42 58.06,28.38 arc90 58.22,28.23 arc90 58.37,28.38 58.37,29.41 arc-90 58.52,29.57 arc-90 58.67,29.41 58.67,28.65 arc90 58.83,28.5 arc90 58.98,28.65 58.98,29.41 arc-90 59.13,29.57 arc-90 59.28,29.41 59.28,28.65 arc90 59.44,28.5 arc90 59.59,28.65 59.59,29.41 arc-90 59.74,29.57 arc-90 59.89,29.41 59.89,29.09 arc90 60.05,28.94 arc90 60.2,29.09 60.2,29.72 arc90 60.05,29.87 56.46,29.87 arc-90 56.31,30.02 56.31,30.32 arc90 56.16,30.47 arc90 56.01,30.32 56.01,30.02 arc-90 55.85,29.87 arc-90 55.7,30.02 55.7,30.91 arc90 55.55,31.06 arc90 55.4,30.91 55.4,30.02 arc-90 55.24,29.87 53.67,29.87 53.31,30.23 53.31,30.83 RM2.3.2
D9
  Top 0.127: 54.86,19.74 54.86,20.13 | 53.45,19.53 53.86,19.53 | 54.26,19.53 54.65,19.53
  Top 0.152: 54.86,20.13 54.86,20.55 55.04,20.73 U2.C3 | 54.65,19.53 54.86,19.74 | 53.86,19.53 54.26,19.53 | RM4.3.2 49.18,22.05 49.58,22.05 50.44,21.18 50.44,20.4 arc90 50.6,20.24 arc90 50.75,20.4 50.75,20.88 arc-90 50.9,21.03 arc-90 51.05,20.88 51.05,20.34 arc90 51.21,20.19 arc90 51.36,20.34 51.36,20.88 arc-90 51.51,21.03 arc-90 51.66,20.88 51.66,20.27 arc90 51.82,20.12 arc90 51.97,20.27 51.97,20.88 arc-90 52.12,21.03 arc-90 52.27,20.88 52.27,19.91 arc90 52.43,19.76 arc90 52.58,19.91 52.58,20.55 arc-90 52.73,20.7 arc-90 52.88,20.55 52.88,19.71 53.01,19.58 53.39,19.58 53.45,19.53
D10
  Top 0.127: 54.86,25.33 54.86,25.73
  Top 0.152: 54.86,25.33 54.86,24.91 55.04,24.73 U2.C8 | 54.86,25.73 54.86,25.83 54.93,25.9 54.93,26.21 55,26.29 55.85,26.29 56.46,26.9 56.99,26.9 57.22,27.13 57.66,27.13 57.97,27.43 58.34,27.43 58.8,27.89 59.95,27.89 60.81,28.75 60.81,29.72 arc-90 60.96,29.87 61.34,29.87 arc90 61.49,30.02 arc90 61.34,30.18 60.96,30.18 arc-90 60.81,30.33 arc-90 60.96,30.48 61.34,30.48 arc90 61.49,30.63 arc90 61.34,30.79 60.96,30.79 arc-90 60.81,30.94 arc-90 60.96,31.09 61.34,31.09 arc90 61.49,31.24 arc90 61.34,31.39 60.96,31.39 arc-90 60.81,31.55 arc-90 60.96,31.7 61.34,31.7 arc90 61.49,31.85 arc90 61.34,32 60.96,32 arc-90 60.81,32.16 60.81,33.71 60.68,33.83 59.56,33.83 59.44,33.71 59.44,31.13 58.86,30.56 57,30.56 55.89,31.66 55.89,32.31 55.82,32.38 54.88,32.38 54.8,32.31 54.8,30.63 54.72,30.56 54.51,30.56 54.41,30.66 RM2.1.2
D11
  Top 0.127: 54.86,18.88 54.86,19.32
  Top 0.152: 54.86,19.32 55.22,19.68 55.22,19.89 U2.C2 | 54.86,18.88 54.35,18.36 53.85,18.36 arc-90 53.72,18.49 53.72,18.52 arc90 53.57,18.67 53.49,18.67 arc90 53.34,18.52 arc-90 53.19,18.36 52.74,18.36 52.58,18.53 52.58,19.23 52.35,19.46 51.98,19.46 51.55,19.89 50.44,19.89 49.99,20.34 49.99,21.03 arc90 49.84,21.18 49.76,21.18 arc90 49.61,21.03 49.61,20.95 arc-90 49.45,20.8 49.38,20.8 arc-90 49.23,20.95 49.23,21.03 arc90 49.07,21.18 49,21.18 arc90 48.84,21.03 48.84,20.95 arc-90 48.69,20.8 47.37,20.8 arc-90 47.22,20.95 47.22,21.03 arc-90 47.37,21.18 48.5,21.18 48.88,21.56 RM4.4.2
D12
  Top 0.152: RM2.4.2 52.81,30.86 52.81,30.3 53.54,29.57 57.89,29.57 arc-90 58.06,29.39 58.06,29.05 arc-90 57.91,28.89 arc-90 57.76,29.05 57.76,29.11 arc90 57.61,29.26 arc90 57.45,29.11 57.45,28.28 arc-90 57.3,28.13 arc-90 57.15,28.28 57.15,29.11 arc90 57,29.26 arc90 56.84,29.11 56.84,28.12 arc-90 56.69,27.96 arc-90 56.54,28.12 56.54,29.11 arc90 56.39,29.26 arc90 56.24,29.11 56.24,27.96 arc-90 56.08,27.81 arc-90 55.93,27.96 55.93,29.11 arc90 55.78,29.26 arc90 55.63,29.11 55.63,27.43 arc-90 55.47,27.28 arc-90 55.32,27.43 55.32,29.11 arc90 55.17,29.26 arc90 55.02,29.11 55.02,27.28 54.94,27.2 53.57,27.2 53.42,27.36 52.65,27.36 52.58,27.28 52.58,24.66 53.39,23.85 53.58,23.85 U2.A7
D13
  Top 0.152: U2.A2 53.19,20.4 53.19,21.18 arc90 53.03,21.34 arc90 52.88,21.18 arc-90 52.73,21.03 arc-90 52.58,21.18 arc90 52.43,21.34 50.74,21.34 49.52,22.55 49.17,22.55 RM4.2.2
D14
  Top 0.127: 54.06,25.33 54.06,25.73
  Top 0.152: U2.B8 54.24,24.73 54.06,24.91 54.06,25.33 | 54.06,25.73 54.06,25.78 53.8,26.04 53.8,26.26 54.13,26.59 55.72,26.59 56.33,27.2 56.86,27.2 57.09,27.43 57.54,27.43 57.84,27.74 58.22,27.74 58.67,28.19 59.74,28.19 arc90 59.89,28.35 59.89,28.47 arc-90 60.05,28.63 60.25,28.63 60.5,28.88 60.5,33.07 arc90 60.35,33.22 60.01,33.22 arc90 59.85,33.07 arc90 60.01,32.92 60.05,32.92 arc-90 60.2,32.77 arc-90 60.05,32.61 59.89,32.61 arc90 59.74,32.46 arc90 59.89,32.31 60.05,32.31 arc-90 60.2,32.16 arc-90 60.05,32 59.89,32 arc90 59.74,31.85 arc90 59.89,31.7 60.05,31.7 arc-90 60.2,31.55 arc-90 60.05,31.39 59.89,31.39 arc90 59.74,31.24 arc90 59.89,31.09 60.05,31.09 arc-90 60.2,30.94 arc-90 60.05,30.79 59.59,30.79 arc90 59.44,30.63 arc90 59.59,30.48 60.05,30.48 arc-90 60.2,30.33 arc-90 60.05,30.18 56.95,30.18 55.6,31.52 55.6,32 55.52,32.08 55.17,32.08 55.09,32 55.09,30.49 54.85,30.25 54,30.25 53.87,30.38 RM2.2.2
D15
  Top 0.152: U2.A3 53.49,20.89 53.49,21.03 53.81,21.35 53.81,21.55 53.72,21.64 52.27,21.64 arc-90 52.12,21.79 52.12,22.02 arc90 51.97,22.17 arc90 51.82,22.02 51.82,21.79 arc-90 51.66,21.64 arc-90 51.51,21.79 51.51,22.12 arc90 51.36,22.28 arc90 51.21,22.12 51.21,21.79 arc-90 51.05,21.64 50.93,21.64 49.51,23.06 49.21,23.06 RM4.1.2
DDR3_A0
  Top 0.152: U1.64 58.71,48.07 58.85,47.93 65.84,47.93 69.7,44.07 69.7,42.9 70.44,42.16 RM5.1.1
DDR3_A1
  Top 0.152: RM6.3.1 66.53,36.22 66.65,36.35 66.65,39.4 62.77,43.27 U1.52
DDR3_A2
  Top 0.152: U1.66 58.77,48.87 59.11,48.54 66.09,48.54 70.31,44.32 70.31,43.13 71.12,42.32 71.12,36.96 70.69,36.53 RM8.3.1
DDR3_A3
  Top 0.152: U1.65 58.74,48.47 58.98,48.23 65.96,48.23 70,44.2 70,43 70.81,42.19 70.81,37.08 70.15,36.42 RM8.4.1
DDR3_A4
  Top 0.152: RM6.4.1 66.04,36 66.04,36.25 66.34,36.55 66.34,39.27 62.74,42.87 U1.51
DDR3_A5
  Top 0.152: U1.67 58.8,49.27 59.23,48.84 66.22,48.84 70.61,44.45 70.61,43.26 71.42,42.44 71.42,36.83 71.19,36.6 RM8.2.1
DDR3_A6
  Top 0.152: U1.54 64.11,44.07 66.95,41.22 66.95,36.3 67.03,36.22 RM6.2.1
DDR3_A7
  Top 0.152: U1.71 58.93,50.87 59.74,50.06 66.73,50.06 70.99,45.8 71.78,45.8 72.33,45.24 RM10.2.1
DDR3_A8
  Top 0.152: U1.55 64.14,44.47 67.26,41.35 67.26,36.5 67.57,36.19 RM6.1.1
DDR3_A9
  Top 0.152: U1.69 58.87,50.07 59.49,49.45 66.47,49.45 70.74,45.19 71.17,45.19 71.3,45.06 RM10.4.1
DDR3_A10
  Top 0.152: U1.48 62.65,41.67 64.93,39.39 RM7.3.1
DDR3_A11
  Top 0.152: U1.56 64.17,44.87 67.56,41.48 67.56,39.3 RM9.4.1
DDR3_A12
  Top 0.152: U1.50 62.71,42.47 65.89,39.29 65.89,38.92 RM7.1.1
DDR3_A13
  Top 0.152: U1.68 58.84,49.67 59.36,49.15 66.34,49.15 70.92,44.58 70.92,43.38 71.73,42.57 RM8.1.1
DDR3_A14
  Top 0.152: U1.57 64.2,45.27 67.87,41.6 67.87,39.81 68.18,39.51 RM9.3.1
DDR3_BA0
  Top 0.152: U1.63 58.65,47.67 58.7,47.62 65.71,47.62 69.39,43.94 69.39,42.62 69.9,42.12 RM5.2.1
DDR3_BA1
  Top 0.152: U1.49 62.68,42.07 65.43,39.32 RM7.2.1
DDR3_BA2
  Top 0.152: U1.61 64.33,46.87 68.83,42.37 69.14,42.37 69.4,42.11 RM5.3.1
DDR3_CAS
  Top 0.152: U1.59 64.27,46.07 68.48,41.86 68.48,40.21 69.22,39.47 RM9.1.1
DDR3_CK
  Top 0.114: U1.45 58.08,40.51 58.75,40.51 58.85,40.62 61.51,40.62 61.58,40.54 61.58,40.31 61.51,40.23 61.06,40.23 R71.2
DDR3_CK_N
  Top 0.114: U1.46 58.06,40.92 61.66,40.92 61.9,40.68 61.9,40.26 R70.2
DDR3_CKE
  Top 0.152: U1.47 62.61,41.27 63.4,40.49 63.4,40.39 arc90 63.55,40.23 arc-90 63.7,40.08 arc-90 63.55,39.93 arc90 63.4,39.78 arc90 63.55,39.62 arc-90 63.7,39.47 arc-90 63.55,39.32 arc90 63.4,39.17 arc90 63.55,39.01 arc-90 63.7,38.86 arc-90 63.55,38.71 arc90 63.4,38.56 arc90 63.55,38.41 arc-90 63.7,38.25 arc-90 63.55,38.1 arc90 63.4,37.95 arc90 63.55,37.8 arc-90 63.7,37.64 arc-90 63.55,37.49 arc90 63.4,37.34 arc90 63.55,37.19 63.84,37.19 arc90 63.99,37.34 63.99,39.4 arc-90 64.15,39.55 64.29,39.55 64.39,39.45 RM7.4.1
DDR3_D0
  Top 0.152: U1.22 46.97,37.67 46.94,37.64 46.94,37.44 46.71,37.21 46.71,36.7 45.26,35.26 45.26,35.15 arc90 45.41,35 45.59,35 arc-90 45.74,34.85 arc-90 45.59,34.7 45.41,34.7 arc90 45.26,34.54 arc90 45.41,34.39 45.59,34.39 arc-90 45.74,34.24 arc-90 45.59,34.09 45.19,34.09 arc90 45.03,33.93 45.03,33.17 43.97,32.11 43.97,22.45 46,20.42 RM1.1.1
DDR3_D1
  Top 0.152: U1.40 54.17,37.5 54.33,37.34 54.33,32.77 54.41,32.69 55.78,32.69 55.85,32.77 55.85,33.38 55.93,33.45 56.17,33.45 56.27,33.35 RM3.4.1
DDR3_D2
  Top 0.152: RM1.2.1 46.1,19.88 43.66,22.33 43.66,32.38 arc-90 43.84,32.56 43.87,32.56 arc90 44.02,32.72 arc90 43.87,32.87 43.81,32.87 arc-90 43.66,33.02 arc-90 43.81,33.17 44.45,33.17 arc90 44.6,33.33 arc90 44.45,33.48 44.22,33.48 arc-90 44.07,33.63 arc-90 44.22,33.78 44.58,33.78 arc90 44.73,33.93 arc90 44.58,34.09 arc-90 44.42,34.24 arc-90 44.58,34.39 44.78,34.39 arc90 44.96,34.57 44.96,35.38 46.41,36.83 46.41,37.34 46.56,37.49 46.56,38.21 U1.21
DDR3_D3
  Top 0.152: U1.41 54.57,37.53 54.63,37.47 54.63,33.07 54.71,32.99 55.47,32.99 55.55,33.07 55.55,33.68 55.63,33.76 56.68,33.76 56.81,33.63 RM3.3.1
DDR3_D4
  Top 0.152: U1.19 45.77,37.06 43.05,34.34 43.05,22.07 46.28,18.84 RM1.4.1
DDR3_D5
  Top 0.152: RM3.1.1 57.77,33.2 57.77,33.54 57.07,34.24 57.07,35.28 arc90 56.92,35.43 56.62,35.43 arc-90 56.47,35.59 arc-90 56.62,35.74 56.92,35.74 arc90 57.07,35.89 arc90 56.92,36.04 56.62,36.04 arc-90 56.46,36.2 arc-90 56.62,36.35 56.92,36.35 arc90 57.07,36.5 arc90 56.92,36.65 56.62,36.65 arc-90 56.46,36.8 arc-90 56.62,36.96 57.4,36.96 arc90 57.56,37.11 arc90 57.4,37.26 56.62,37.26 arc-90 56.46,37.41 arc-90 56.62,37.57 57.4,37.57 arc90 57.56,37.72 arc90 57.4,37.87 55.77,37.87 U1.44
DDR3_D6
  Top 0.152: RM1.3.1 46.17,19.38 43.36,22.2 43.36,33.22 arc-90 43.61,33.48 arc90 43.76,33.63 arc90 43.61,33.78 43.51,33.78 arc-90 43.36,33.93 arc-90 43.51,34.09 43.97,34.09 arc90 44.12,34.24 arc90 43.97,34.39 43.92,34.39 arc-90 43.76,34.54 arc-90 43.92,34.7 44.5,34.7 arc90 44.65,34.85 arc90 44.5,35 arc-90 44.35,35.15 44.35,35.2 46.1,36.96 46.1,37.47 46.15,37.52 46.15,38.21 U1.20
DDR3_D7
  Top 0.152: U1.42 54.97,37.67 54.94,37.64 54.94,33.38 55.02,33.3 55.17,33.3 55.24,33.38 55.24,33.98 55.32,34.06 56.81,34.06 57.31,33.56 RM3.2.1
DDR3_D8
  Top 0.152: U1.37 52.97,37.41 53.42,36.96 53.42,31.95 RM2.3.1
DDR3_D9
  Top 0.152: U1.25 48.17,37.25 47.7,36.78 47.7,32.79 47.22,32.31 45.03,32.31 44.58,31.85 44.58,22.71 45.49,21.79 47.4,21.79 47.7,22.1 RM4.3.1
DDR3_D10
  Top 0.152: U1.39 53.77,37.47 54.03,37.21 54.03,32.54 54.41,32.15 RM2.1.1
DDR3_D11
  Top 0.152: U1.24 47.77,37.28 47.4,36.91 47.4,32.92 47.09,32.61 44.91,32.61 44.27,31.98 44.27,22.58 45.36,21.49 47.8,21.49 47.88,21.56 RM4.4.1
DDR3_D12
  Top 0.152: U1.36 52.57,37.37 53.11,36.83 53.11,33.83 arc-90 52.96,33.68 52.81,33.68 arc90 52.65,33.53 arc90 52.81,33.38 52.96,33.38 arc-90 53.11,33.22 arc-90 52.96,33.07 52.81,33.07 arc90 52.65,32.92 arc90 52.81,32.77 52.96,32.77 arc-90 53.11,32.61 arc-90 52.96,32.46 arc90 52.81,32.31 52.81,31.93 RM2.4.1
DDR3_D13
  Top 0.152: RM4.2.1 48.06,22.55 47.7,22.55 47.24,22.1 45.62,22.1 44.88,22.84 44.88,31.7 44.96,31.77 45.11,31.77 45.19,31.7 45.19,27.29 45.26,27.22 45.41,27.22 45.49,27.29 45.49,31.64 45.86,32 47.35,32 48.01,32.66 48.01,36.65 48.57,37.21 U1.26
DDR3_D14
  Top 0.152: U1.38 53.37,37.44 53.72,37.08 53.72,32.33 53.87,32.19 RM2.2.1
DDR3_D15
  Top 0.152: RM4.1.1 48.02,23.06 47.73,23.06 47.07,22.4 45.74,22.4 45.19,22.96 45.19,26.84 45.26,26.91 45.41,26.91 45.49,26.84 45.49,23.09 45.57,23.01 45.72,23.01 45.8,23.09 45.8,31.47 46.02,31.7 47.47,31.7 48.31,32.54 48.31,36.52 48.97,37.18 U1.27
DDR3_DM0
  Top 0.152: R64.2 50.32,25.53 47.7,25.53 47.4,25.83 47.4,27 47.62,27.23 47.62,30.71 47.55,30.79 47.4,30.79 47.32,30.71 47.32,27.36 47.24,27.28 47.09,27.28 47.02,27.36 47.02,31.01 47.09,31.09 47.73,31.09 48.92,32.28 48.92,36.27 49.69,37.04 49.69,37.35 49.77,37.42 U1.29
DDR3_DM1
  Top 0.152: U1.28 49.37,37.15 48.62,36.4 48.62,32.41 47.6,31.39 46.18,31.39 46.1,31.32 46.1,27.36 46.18,27.28 46.33,27.28 46.41,27.36 46.41,31.01 46.48,31.09 46.63,31.09 46.71,31.01 46.71,26.49 R65.2
DDR3_DQS0
  Top 0.114: R63.2 47.93,26.64 47.93,30.76 50.44,33.27 50.44,37.03 50.57,37.16 U1.31
DDR3_DQS0_N
  Top 0.114: U1.32 50.97,37.15 50.75,36.93 50.75,33.15 48.23,30.63 48.23,27.69 48.92,27 48.92,26.75 49.1,26.57 49.53,26.57 R62.2
DDR3_DQS1
  Top 0.114: R69.2 49.53,30.53 49.53,30.81 49.89,31.17 51.36,31.17 51.66,30.86 51.66,28.25 51.74,28.17 51.89,28.17 51.97,28.25 51.97,28.8 52.2,29.03 52.65,29.03 52.88,28.8 52.88,28.04 52.96,27.96 53.11,27.96 53.19,28.04 53.19,28.35 53.42,28.57 53.87,28.57 54.1,28.35 54.1,28.04 54.18,27.96 54.33,27.96 54.41,28.04 54.41,28.75 54.24,28.92 53.23,28.92 52.17,29.97 52.17,31.41 52.03,31.55 50.52,31.55 50.29,31.77 50.29,32.23 50.52,32.46 51.98,32.46 52.05,32.52 52.05,32.7 51.98,32.77 51.51,32.77 51.28,32.99 51.28,37.43 51.37,37.51 U1.33
DDR3_DQS1_N
  Top 0.114: R66.2 50.48,30.19 50.01,30.19 49.86,30.34 49.86,30.62 50.1,30.86 51.21,30.86 51.36,30.71 51.36,28.07 51.56,27.87 52.05,27.87 52.27,28.09 52.27,28.65 52.35,28.73 52.5,28.73 52.58,28.65 52.58,27.86 52.78,27.66 53.28,27.66 53.49,27.88 53.49,28.19 53.57,28.27 53.72,28.27 53.8,28.19 53.8,27.89 54.03,27.66 54.48,27.66 54.71,27.89 54.71,28.88 54.37,29.22 53.38,29.22 52.48,30.12 52.48,31.55 52.17,31.85 50.67,31.85 50.6,31.93 50.6,32.08 50.67,32.16 52.12,32.16 52.35,32.38 52.35,32.84 52.12,33.07 51.66,33.07 51.59,33.15 51.59,37.3 51.77,37.48 U1.34
DDR3_ODT
  Top 0.152: RM10.1.2 72.88,43.28 73.03,43.13 73.03,25.07 66.58,18.63 61.36,18.63 U2.K1
DDR3_ODTT
  Top 0.152: U1.72 58.96,51.27 59.87,50.37 66.85,50.37 71.04,46.18 71.88,46.18 72.8,45.26 72.8,44.94 RM10.1.1
DDR3_RAS
  Top 0.152: U1.58 64.23,45.67 68.17,41.73 68.17,40.01 68.68,39.5 RM9.2.1
DDR3_RST
  Top 0.152: RM10.3.2 71.83,43.38 72.42,42.8 72.42,25.32 67.02,19.93 U2.T2
DDR3_RSTT
  Top 0.152: U1.70 58.9,50.47 59.61,49.76 66.6,49.76 70.87,45.49 71.58,45.49 71.83,45.23 RM10.3.1
DDR3_WE
  Top 0.152: U1.60 64.3,46.47 68.86,41.91 RM5.4.1
DQM0
  Top 0.152: U2.E7 57.32,23.47 57.77,23.47 arc-90 57.92,23.32 57.92,23.09 arc-90 57.77,22.94 57.15,22.94 arc-90 57,23.09 57,23.24 arc90 56.84,23.39 arc90 56.69,23.24 56.69,23.09 arc-90 56.54,22.94 arc-90 56.39,23.09 56.39,23.32 arc90 56.24,23.47 arc90 56.08,23.32 56.08,23.09 arc-90 55.93,22.94 arc-90 55.78,23.09 55.78,23.32 arc90 55.63,23.47 arc90 55.47,23.32 55.47,23.01 arc-90 55.32,22.86 53.09,22.86 51.31,24.64 R64.1
DQM1
  Top 0.152: R65.1 46.1,24.11 46.1,22.86 46.18,22.78 46.33,22.78 46.41,22.86 46.41,23.62 46.48,23.7 46.63,23.7 46.71,23.62 46.71,22.86 46.79,22.78 46.94,22.78 47.68,23.52 49.55,23.52 50.49,22.58 52.07,22.58 52.7,21.95 53.9,21.95 54.66,21.18 55.6,21.18 U2.D3
DQS0
  Top 0.114: R63.1 48.16,24.55 48.86,23.85 50.04,23.85 50.95,22.94 52.15,22.94 52.83,22.25 54.03,22.25 54.79,21.49 56.69,21.49 56.92,21.72 56.92,21.87 57.3,22.25 58.32,22.25 59,22.94 59.87,22.94 60.25,22.55 61.4,22.55 61.49,22.47 61.49,22.34 61.4,22.25 60.35,22.25 60.2,22.1 60.2,21.57 60.12,21.49 59.97,21.49 59.89,21.57 59.89,22.41 59.66,22.63 59.21,22.63 58.98,22.41 58.98,21.56 58.9,21.48 58.75,21.48 58.67,21.56 58.67,21.79 58.52,21.95 57.45,21.95 57.23,21.72 57.23,21.12 57.62,20.73 U2.F3
DQS0_N